# EAGLE design inktime_schematic (EAGLE 9.7.0)

## Sheet 1 of 2
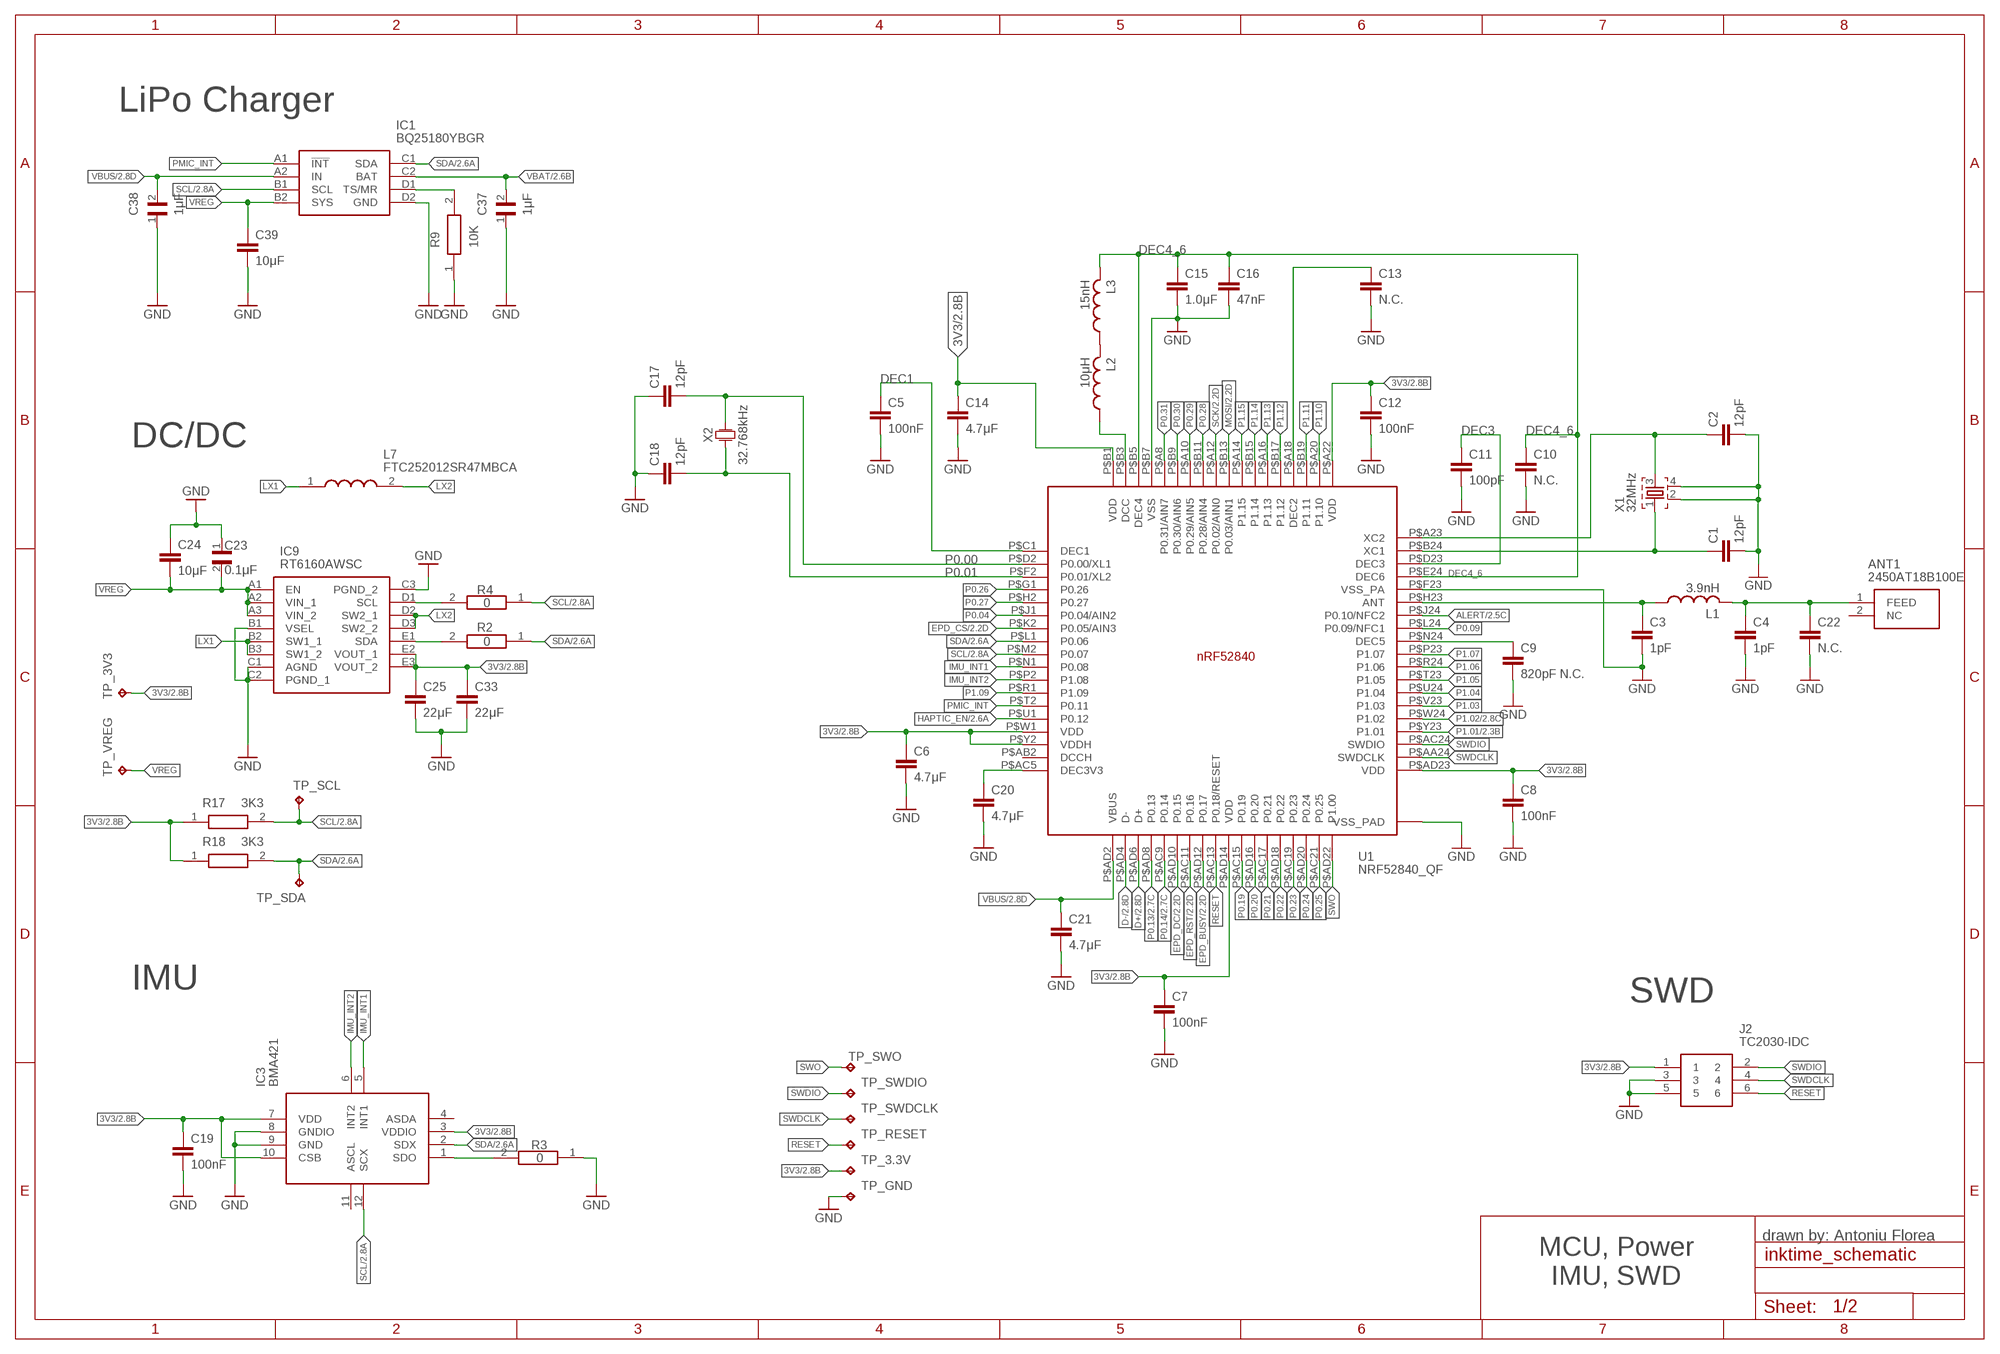
[diagram p0: schematic, sheet 1]

### Parts
ANT1  2450AT18B100E  2450AT18B100E_2450AT18B100E  [2450AT18B100E_ANTC3216X140N]
C1  12pF  NORDIC_NRF_3_CAPACITOR_0201_L  [NORDIC_NRF_3_RESC0201_L]
C2  12pF  NORDIC_NRF_3_CAPACITOR_0201_L  [NORDIC_NRF_3_RESC0201_L]
C3  1pF  NORDIC_NRF_3_CAPACITOR_0201_L  [NORDIC_NRF_3_RESC0201_L]
C4  1pF  NORDIC_NRF_3_CAPACITOR_0201_L  [NORDIC_NRF_3_RESC0201_L]
C5  100nF  NORDIC_NRF_3_CAPACITOR_0201_L  [NORDIC_NRF_3_RESC0201_L]
C6  4.7μF  NORDIC_NRF_3_CAPACITOR_0402_L  [NORDIC_NRF_3_RESC0402_L]
C7  100nF  NORDIC_NRF_3_CAPACITOR_0201_L  [NORDIC_NRF_3_RESC0201_L]
C8  100nF  NORDIC_NRF_3_CAPACITOR_0201_L  [NORDIC_NRF_3_RESC0201_L]
C9  820pF N.C.  NORDIC_NRF_3_CAPACITOR_0201_L  [NORDIC_NRF_3_RESC0201_L]
C10  N.C.  NORDIC_NRF_3_CAPACITOR_0201_L  [NORDIC_NRF_3_RESC0201_L]
C11  100pF  NORDIC_NRF_3_CAPACITOR_0201_L  [NORDIC_NRF_3_RESC0201_L]
C12  100nF  NORDIC_NRF_3_CAPACITOR_0201_L  [NORDIC_NRF_3_RESC0201_L]
C13  N.C.  NORDIC_NRF_3_CAPACITOR_0201_L  [NORDIC_NRF_3_RESC0201_L]
C14  4.7μF  NORDIC_NRF_3_CAPACITOR_0402_L  [NORDIC_NRF_3_RESC0402_L]
C15  1.0μF  NORDIC_NRF_3_CAPACITOR_0402_L  [NORDIC_NRF_3_RESC0402_L]
C16  47nF  NORDIC_NRF_3_CAPACITOR_0201_L  [NORDIC_NRF_3_RESC0201_L]
C17  12pF  NORDIC_NRF_3_CAPACITOR_0201_L  [NORDIC_NRF_3_RESC0201_L]
C18  12pF  NORDIC_NRF_3_CAPACITOR_0201_L  [NORDIC_NRF_3_RESC0201_L]
C19  100nF  NORDIC_NRF_3_CAPACITOR_0201_L  [NORDIC_NRF_3_RESC0201_L]
C20  4.7μF  NORDIC_NRF_3_CAPACITOR_0402_L  [NORDIC_NRF_3_RESC0402_L]
C21  4.7μF  NORDIC_NRF_3_CAPACITOR_0402_L  [NORDIC_NRF_3_RESC0402_L]
C22  N.C.  NORDIC_NRF_3_CAPACITOR_0201_L  [NORDIC_NRF_3_RESC0201_L]
C23  0.1μF  GRM011R60J152KE01L_2_GRM011R60J152KE01L  [GRM011R60J152KE01L_2_CAPC0201X13N]
C24  10μF  NORDIC_NRF_3_CAPACITOR_0402_L  [NORDIC_NRF_3_RESC0402_L]
C25  22μF  NORDIC_NRF_3_CAPACITOR_0402_L  [NORDIC_NRF_3_RESC0402_L]
C33  22μF  NORDIC_NRF_3_CAPACITOR_0402_L  [NORDIC_NRF_3_RESC0402_L]
C37  1μF  GRM011R60J152KE01L_2_GRM011R60J152KE01L  [GRM011R60J152KE01L_2_CAPC0201X13N]
C38  1μF  GRM011R60J152KE01L_2_GRM011R60J152KE01L  [GRM011R60J152KE01L_2_CAPC0201X13N]
C39  10μF  NORDIC_NRF_3_CAPACITOR_0402_L  [NORDIC_NRF_3_RESC0402_L]
IC1  BQ25180YBGR  BQ25180YBGR_BQ25180YBGR  [BQ25180YBGR_BGA8C40P2X4_100X155X50]
IC3  BMA421  BMA423_BMA423  [BMA423_BMA423]
IC9  RT6160AWSC  RT6160AWSC_RT6160AWSC  [RT6160AWSC_BGA15C40P3X5_140X230X60]
J2  TC2030-IDC  TC2030-IDC_TC2030-IDC  [TC2030-IDC_TC2030IDC]
L1  3.9nH  NORDIC_NRF_2_INDUCTOR_0201_L  [NORDIC_NRF_2_RESC0201_L]
L2  10μH  NORDIC_NRF_2_INDUCTOR_0201_L  [NORDIC_NRF_2_RESC0201_L]
L3  15nH  NORDIC_NRF_2_INDUCTOR_0201_L  [NORDIC_NRF_2_RESC0201_L]
L7  FTC252012SR47MBCA  MLP2016SR47MT0S1_FTC252012SR47MBCA  [MLP2016SR47MT0S1_INDC2016X100N]
R2  0  CPF0201D7K68C1_CPF0201D7K68C1  [CPF0201D7K68C1_0201]
R3  0  CPF0201D7K68C1_CPF0201D7K68C1  [CPF0201D7K68C1_0201]
R4  0  CPF0201D7K68C1_CPF0201D7K68C1  [CPF0201D7K68C1_0201]
R9  10K  ERA-1AEB3401C_CPF0201D7K68C1  [ERA-1AEB3401C_0201]
R17  3K3  CPF0201D7K68C1_CPF0201D7K68C1  [CPF0201D7K68C1_0201]
R18  3K3  CPF0201D7K68C1_CPF0201D7K68C1  [CPF0201D7K68C1_0201]
TP_3.3V  HECTOR_WATCH_1_TPTP20R  [HECTOR_WATCH_1_TP20R]
TP_3V3  HECTOR_WATCH_1_TPTP20R  [HECTOR_WATCH_1_TP20R]
TP_GND  HECTOR_WATCH_1_TPTP20R  [HECTOR_WATCH_1_TP20R]
TP_RESET  HECTOR_WATCH_1_TPTP20R  [HECTOR_WATCH_1_TP20R]
TP_SCL  HECTOR_WATCH_1_TPTP20R  [HECTOR_WATCH_1_TP20R]
TP_SDA  HECTOR_WATCH_1_TPTP20R  [HECTOR_WATCH_1_TP20R]
TP_SWDCLK  HECTOR_WATCH_1_TPTP20R  [HECTOR_WATCH_1_TP20R]
TP_SWDIO  HECTOR_WATCH_1_TPTP20R  [HECTOR_WATCH_1_TP20R]
TP_SWO  HECTOR_WATCH_1_TPTP20R  [HECTOR_WATCH_1_TP20R]
TP_VREG  HECTOR_WATCH_1_TPTP20R  [HECTOR_WATCH_1_TP20R]
U1  NRF52840_QF  NORDIC_NRF_4_NRF52840_QF  [NORDIC_NRF_4_AQFN50P700X700X85_HS-74N]
X1  32MHz  NORDIC_NRF_XTAL_32MHZ  [NORDIC_NRF_BT-XTAL_2016_N]
X2  32.768kHz  FC-135  [XTAL330X1051X90N]

### Nets
3V3: C6.1 C7.1 C8.1 C12.1 C14.1 C19.1 C25.1 C33.1 IC3.3(VDDIO) IC3.7(VDD) IC3.10(CSB) IC9.E2(VOUT_1) IC9.E3(VOUT_2) J2.1 R17.1 R18.1 TP_3.3V.TP TP_3V3.TP U1.P$A22(VDD) U1.P$AD14(VDD) U1.P$AD23(VDD) U1.P$B1(VDD) U1.P$W1(VDD) U1.P$Y2(VDDH) ; also sheet 2
ALERT: U1.P$J24(P0.10/NFC2) ; also sheet 2
D+: U1.P$AD6(D+) ; also sheet 2
D-: U1.P$AD4(D-) ; also sheet 2
DEC1: C5.1 U1.P$C1(DEC1)
DEC3: C11.1 U1.P$D23(DEC3)
DEC4_6: C10.1 C15.1 C16.1 L3.2 U1.P$B5(DEC4) U1.P$E24(DEC6)
EPD_BUSY: U1.P$AD12(P0.17) ; also sheet 2
EPD_CS: U1.P$K2(P0.05/AIN3) ; also sheet 2
EPD_DC: U1.P$AD10(P0.15) ; also sheet 2
EPD_RST: U1.P$AC11(P0.16) ; also sheet 2
GND: C1.2 C2.2 C3.2 C4.2 C5.2 C6.2 C7.2 C8.2 C9.2 C10.2 C11.2 C12.2 C13.2 C14.2 C15.2 C16.2 C17.1 C18.1 C19.2 C20.2 C21.2 C22.2 C23.1 C24.1 C25.2 C33.2 C37.1 C38.1 C39.2 IC1.D2(GND) IC3.8(GNDIO) IC3.9(GND) IC9.B1(VSEL) IC9.C1(AGND) IC9.C2(PGND_1) IC9.C3(PGND_2) J2.3 J2.5 R3.1 R9.1 TP_GND.TP U1.P$74(VSS_PAD) U1.P$75(VSS_PAD) U1.P$76(VSS_PAD) U1.P$77(VSS_PAD) U1.P$78(VSS_PAD) U1.P$79(VSS_PAD) U1.P$80(VSS_PAD) U1.P$81(VSS_PAD) U1.P$82(VSS_PAD) U1.P$83(VSS_PAD) U1.P$84(VSS_PAD) U1.P$85(VSS_PAD) U1.P$86(VSS_PAD) U1.P$87(VSS_PAD) U1.P$88(VSS_PAD) U1.P$89(VSS_PAD) U1.P$90(VSS_PAD) U1.P$B7(VSS) U1.P$F23(VSS_PA) X1.2 X1.4 ; also sheet 2
HAPTIC_EN: U1.P$U1(P0.12) ; also sheet 2
IMU_INT1: IC3.5(INT1) U1.P$N1(P0.08)
IMU_INT2: IC3.6(INT2) U1.P$P2(P1.08)
LX1: IC9.B2(SW1_1) IC9.B3(SW1_2) L7.1
LX2: IC9.D2(SW2_1) IC9.D3(SW2_2) L7.2
MOSI: U1.P$B13(P0.03/AIN1) ; also sheet 2
N$1: C1.1 U1.P$B24(XC1) X1.1
N$2: C3.1 L1.1 U1.P$H23(ANT)
N$3: C2.1 U1.P$A23(XC2) X1.3
N$4: ANT1.1(FEED) C4.1 C22.1 L1.2
N$5: C9.1 U1.P$N24(DEC5)
N$6: C20.1 U1.P$AC5(DEC3V3)
N$7: L2.1 U1.P$B3(DCC)
N$8: L2.2 L3.1
N$9: IC9.D1(SCL) R4.2
N$10: C13.1 U1.P$A18(DEC2)
N$12: IC1.D1(TS/MR) R9.2
N$13: IC9.E1(SDA) R2.2
N$19: IC3.1(SDO) R3.2
P0.00: C17.2 U1.P$D2(P0.00/XL1) X2.2
P0.01: C18.2 U1.P$F2(P0.01/XL2) X2.1
P0.04: U1.P$J1(P0.04/AIN2)
P0.09: U1.P$L24(P0.09/NFC1)
P0.13: U1.P$AD8(P0.13) ; also sheet 2
P0.14: U1.P$AC9(P0.14) ; also sheet 2
P0.19: U1.P$AC15(P0.19)
P0.20: U1.P$AD16(P0.20)
P0.21: U1.P$AC17(P0.21)
P0.22: U1.P$AD18(P0.22)
P0.23: U1.P$AC19(P0.23)
P0.24: U1.P$AD20(P0.24)
P0.25: U1.P$AC21(P0.25)
P0.26: U1.P$G1(P0.26)
P0.27: U1.P$H2(P0.27)
P0.28: U1.P$B11(P0.28/AIN4)
P0.29: U1.P$A10(P0.29/AIN5)
P0.30: U1.P$B9(P0.30/AIN6)
P0.31: U1.P$A8(P0.31/AIN7)
P1.01: U1.P$Y23(P1.01) ; also sheet 2
P1.02: U1.P$W24(P1.02) ; also sheet 2
P1.03: U1.P$V23(P1.03)
P1.04: U1.P$U24(P1.04)
P1.05: U1.P$T23(P1.05)
P1.06: U1.P$R24(P1.06)
P1.07: U1.P$P23(P1.07)
P1.09: U1.P$R1(P1.09)
P1.10: U1.P$A20(P1.10)
P1.11: U1.P$B19(P1.11)
P1.12: U1.P$B17(P1.12)
P1.13: U1.P$A16(P1.13)
P1.14: U1.P$B15(P1.14)
P1.15: U1.P$A14(P1.15)
PMIC_INT: IC1.A1(!INT) U1.P$T2(P0.11)
RESET: J2.6 TP_RESET.TP U1.P$AC13(P0.18/RESET)
SCK: U1.P$A12(P0.02/AIN0) ; also sheet 2
SCL: IC1.B1(SCL) IC3.12(SCX) R4.1 R17.2 TP_SCL.TP U1.P$M2(P0.07) ; also sheet 2
SDA: IC1.C1(SDA) IC3.2(SDX) R2.1 R18.2 TP_SDA.TP U1.P$L1(P0.06) ; also sheet 2
SWDCLK: J2.4 TP_SWDCLK.TP U1.P$AA24(SWDCLK)
SWDIO: J2.2 TP_SWDIO.TP U1.P$AC24(SWDIO)
SWO: TP_SWO.TP U1.P$AD22(P1.00)
VBAT: C37.2 IC1.C2(BAT) ; also sheet 2
VBUS: C21.1 C38.2 IC1.A2(IN) U1.P$AD2(VBUS) ; also sheet 2
VREG: C23.2 C24.2 C39.1 IC1.B2(SYS) IC9.A1(EN) IC9.A2(VIN_1) IC9.A3(VIN_2) TP_VREG.TP
Unconnected: ANT1.2(NC) IC3.4(ASDA) IC3.11(ASCL) U1.P$AB2(DCCH)

### Notes on the sheet
- LiPo Charger
- DC/DC
- IMU
- SWD
- drawn by: Antoniu Florea
- MCU, Power
  IMU, SWD

## Sheet 2 of 2
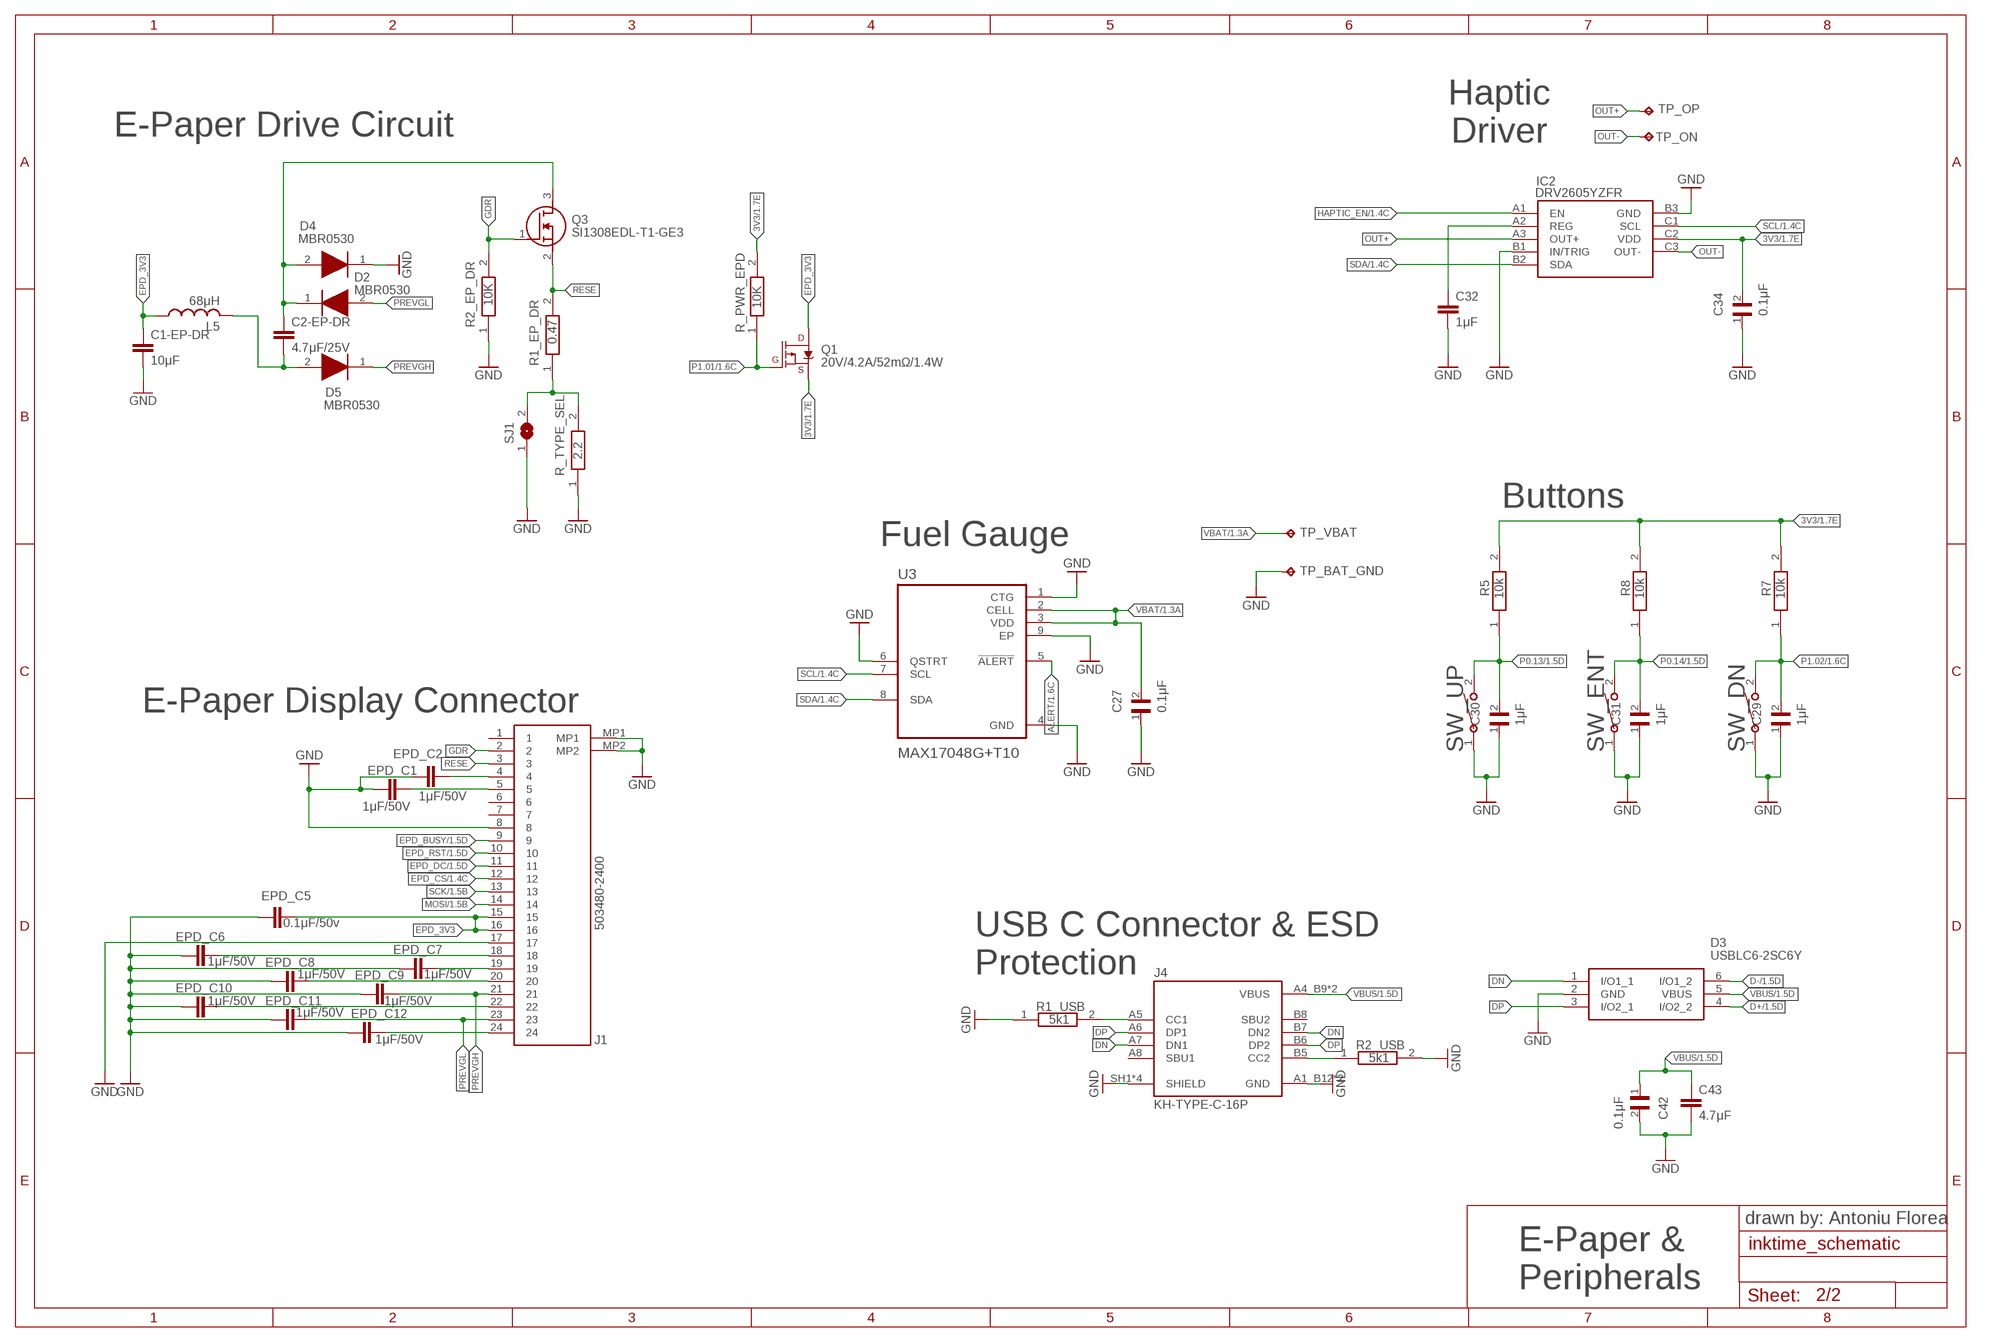
[diagram p1: schematic, sheet 2]

### Parts
C1-EP-DR  10μF  NORDIC_NRF_3_CAPACITOR_0402_L  [NORDIC_NRF_3_RESC0402_L]
C2-EP-DR  4.7μF/25V  NORDIC_NRF_3_CAPACITOR_0402_L  [NORDIC_NRF_3_RESC0402_L]
C27  0.1μF  GRM011R60J152KE01L_2_GRM011R60J152KE01L  [GRM011R60J152KE01L_2_CAPC0201X13N]
C29  1μF  GRM011R60J152KE01L_2_GRM011R60J152KE01L  [GRM011R60J152KE01L_2_CAPC0201X13N]
C30  1μF  GRM011R60J152KE01L_2_GRM011R60J152KE01L  [GRM011R60J152KE01L_2_CAPC0201X13N]
C31  1μF  GRM011R60J152KE01L_2_GRM011R60J152KE01L  [GRM011R60J152KE01L_2_CAPC0201X13N]
C32  1μF  NORDIC_NRF_3_CAPACITOR_0402_L  [NORDIC_NRF_3_RESC0402_L]
C34  0.1μF  GRM011R60J152KE01L_2_GRM011R60J152KE01L  [GRM011R60J152KE01L_2_CAPC0201X13N]
C42  0.1μF  GRM011R60J152KE01L_2_GRM011R60J152KE01L  [GRM011R60J152KE01L_2_CAPC0201X13N]
C43  4.7μF  NORDIC_NRF_3_CAPACITOR_0402_L  [NORDIC_NRF_3_RESC0402_L]
D2  MBR0530  ESP32_C6_LIBRARY_5_MBR0530  [ESP32_C6_LIBRARY_5_SOD3716X135N]
D3  USBLC6-2SC6Y  ESP32_C6_LIBRARY_3_USBLC6-2SC6Y  [ESP32_C6_LIBRARY_3_SOT95P280X145-6N]
D4  MBR0530  ESP32_C6_LIBRARY_5_MBR0530  [ESP32_C6_LIBRARY_5_SOD3716X135N]
D5  MBR0530  ESP32_C6_LIBRARY_5_MBR0530  [ESP32_C6_LIBRARY_5_SOD3716X135N]
EPD_C1  1μF/50V  NORDIC_NRF_3_CAPACITOR_0402_L  [NORDIC_NRF_3_RESC0402_L]
EPD_C2  1μF/50V  NORDIC_NRF_3_CAPACITOR_0402_L  [NORDIC_NRF_3_RESC0402_L]
EPD_C5  0.1μF/50v  NORDIC_NRF_3_CAPACITOR_0201_L  [NORDIC_NRF_3_RESC0201_L]
EPD_C6  1μF/50V  NORDIC_NRF_3_CAPACITOR_0402_L  [NORDIC_NRF_3_RESC0402_L]
EPD_C7  1μF/50V  NORDIC_NRF_3_CAPACITOR_0402_L  [NORDIC_NRF_3_RESC0402_L]
EPD_C8  1μF/50V  NORDIC_NRF_3_CAPACITOR_0402_L  [NORDIC_NRF_3_RESC0402_L]
EPD_C9  1μF/50V  NORDIC_NRF_3_CAPACITOR_0402_L  [NORDIC_NRF_3_RESC0402_L]
EPD_C10  1μF/50V  NORDIC_NRF_3_CAPACITOR_0402_L  [NORDIC_NRF_3_RESC0402_L]
EPD_C11  1μF/50V  NORDIC_NRF_3_CAPACITOR_0402_L  [NORDIC_NRF_3_RESC0402_L]
EPD_C12  1μF/50V  NORDIC_NRF_3_CAPACITOR_0402_L  [NORDIC_NRF_3_RESC0402_L]
IC2  DRV2605YZFR  DRV2605YZFR_DRV2605YZFR  [DRV2605YZFR_BGA9C50P3X3_144X144X62]
J1  503480-2400  503480-2400_503480-2400  [503480-2400_5034802400]
J4  KH-TYPE-C-16P  KH-TYPE-C-16P_KH-TYPE-C-16P  [KH-TYPE-C-16P_KINGHELM_KH-TYPE-C-16P]
L5  68μH  NORDIC_NRF_2_INDUCTOR_0402_L  [NORDIC_NRF_2_RESC0402_L]
Q1  20V/4.2A/52mΩ/1.4W  ESP32_C6_LIBRARY_4_ESP32_WROVER_SPARKFUN-DISCRETESEMI_MOSFET_PCH-DMG2305UX-7  [ESP32_C6_LIBRARY_4_ESP32_C6_LIBRARY_4_ESP32_C6_LIBRARY_4_ESP32_C6_LIBRARY_4_ESP32_WROVER_SPARKFUN-DISCRETESEMI_SOT23-3]
Q3  SI1308EDL-T1-GE3  ESP32_C6_LIBRARY_6_SI1308EDL-T1-GE3  [ESP32_C6_LIBRARY_6_SOT65P210X110-3N]
R1_EP_DR  0.47  CPF0201D7K68C1_CPF0201D7K68C1  [CPF0201D7K68C1_0201]
R1_USB  5k1  ERA-1AEB3401C_CPF0201D7K68C1  [ERA-1AEB3401C_0201]
R2_EP_DR  10K  CPF0201D7K68C1_CPF0201D7K68C1  [CPF0201D7K68C1_0201]
R2_USB  5k1  ERA-1AEB3401C_CPF0201D7K68C1  [ERA-1AEB3401C_0201]
R5  10k  CPF0201D7K68C1_CPF0201D7K68C1  [CPF0201D7K68C1_0201]
R7  10k  CPF0201D7K68C1_CPF0201D7K68C1  [CPF0201D7K68C1_0201]
R8  10k  CPF0201D7K68C1_CPF0201D7K68C1  [CPF0201D7K68C1_0201]
R_PWR_EPD  10K  CPF0201D7K68C1_CPF0201D7K68C1  [CPF0201D7K68C1_0201]
R_TYPE_SEL  2.2  CPF0201D7K68C1_CPF0201D7K68C1  [CPF0201D7K68C1_0201]
SJ1  ESP32_C6_LIBRARY_7_JUMPER_SJ  [ESP32_C6_LIBRARY_7_JUMPER_SJ]
SW_DN  2025-10-22_07-23-44_LIBRARY_EVP-AKE31ASW_EVP-AKE31A_PAN  [2025-10-22_07-23-44_LIBRARY_SW_EVP-AKE31A_PAN]
SW_ENT  2025-10-22_07-23-44_LIBRARY_EVP-AKE31ASW_EVP-AKE31A_PAN  [2025-10-22_07-23-44_LIBRARY_SW_EVP-AKE31A_PAN]
SW_UP  2025-10-22_07-23-44_LIBRARY_EVP-AKE31ASW_EVP-AKE31A_PAN  [2025-10-22_07-23-44_LIBRARY_SW_EVP-AKE31A_PAN]
TP_BAT_GND  HECTOR_WATCH_1_TPTP20R  [HECTOR_WATCH_1_TP20R]
TP_ON  HECTOR_WATCH_1_TPTP20R  [HECTOR_WATCH_1_TP20R]
TP_OP  HECTOR_WATCH_1_TPTP20R  [HECTOR_WATCH_1_TP20R]
TP_VBAT  HECTOR_WATCH_1_TPTP20R  [HECTOR_WATCH_1_TP20R]
U3  MAX17048G+T10  ESP32_C6_LIBRARY_MAX17048G+T10  [ESP32_C6_LIBRARY_SON50P200X200X80-9N]

### Nets
3V3: C34.2 IC2.C2(VDD) Q1.2(S) R5.2 R7.2 R8.2 R_PWR_EPD.2 ; also sheet 1
ALERT: U3.5(!ALERT) ; also sheet 1
D+: D3.4(I/O2_2) ; also sheet 1
D-: D3.6(I/O1_2) ; also sheet 1
DN: D3.1(I/O1_1) J4.A7(DN1) J4.B7(DN2)
DP: D3.3(I/O2_1) J4.A6(DP1) J4.B6(DP2)
EPD_3V3: C1-EP-DR.1 EPD_C5.2 J1.15 J1.16 L5.1 Q1.3(D)
EPD_BUSY: J1.9 ; also sheet 1
EPD_CS: J1.12 ; also sheet 1
EPD_DC: J1.11 ; also sheet 1
EPD_RST: J1.10 ; also sheet 1
GDR: J1.2 Q3.1(G) R2_EP_DR.2
GND: C1-EP-DR.2 C27.1 C29.1 C30.1 C31.1 C32.2 C34.1 C42.2 C43.2 D3.2(GND) D4.1(K) EPD_C1.2 EPD_C2.2 EPD_C5.1 EPD_C6.2 EPD_C7.2 EPD_C8.2 EPD_C9.2 EPD_C10.2 EPD_C11.2 EPD_C12.2 IC2.B1(IN/TRIG) IC2.B3(GND) J1.8 J1.17 J1.MP1 J1.MP2 J4.A1_B12(GND) J4.A12_B1(GND) J4.SH1(SHIELD) J4.SH2(SHIELD) J4.SH3(SHIELD) J4.SH4(SHIELD) R1_USB.1 R2_EP_DR.1 R2_USB.2 R_TYPE_SEL.1 SJ1.1 SW_DN.1 SW_ENT.1 SW_UP.1 TP_BAT_GND.TP U3.1(CTG) U3.4(GND) U3.6(QSTRT) U3.9(EP) ; also sheet 1
HAPTIC_EN: IC2.A1(EN) ; also sheet 1
MOSI: J1.14 ; also sheet 1
N$11: C2-EP-DR.2 D5.2(A) L5.2
N$14: C2-EP-DR.1 D2.1(K) D4.2(A) Q3.3(D)
N$15: EPD_C2.1 J1.4
N$16: R1_EP_DR.1 R_TYPE_SEL.2 SJ1.2
N$17: C32.1 IC2.A2(REG)
N$18: EPD_C1.1 J1.5
N$20: EPD_C6.1 J1.18
N$21: EPD_C7.1 J1.19
N$22: EPD_C8.1 J1.20
N$23: J4.A5(CC1) R1_USB.2
N$24: EPD_C10.1 J1.22
N$26: EPD_C12.1 J1.24
N$28: J4.B5(CC2) R2_USB.1
OUT+: IC2.A3(OUT+) TP_OP.TP
OUT-: IC2.C3(OUT-) TP_ON.TP
P0.13: C30.2 R5.1 SW_UP.2 ; also sheet 1
P0.14: C31.2 R8.1 SW_ENT.2 ; also sheet 1
P1.01: Q1.1(G) R_PWR_EPD.1 ; also sheet 1
P1.02: C29.2 R7.1 SW_DN.2 ; also sheet 1
PREVGH: D5.1(K) EPD_C9.1 J1.21
PREVGL: D2.2(A) EPD_C11.1 J1.23
RESE: J1.3 Q3.2(S) R1_EP_DR.2
SCK: J1.13 ; also sheet 1
SCL: IC2.C1(SCL) U3.7(SCL) ; also sheet 1
SDA: IC2.B2(SDA) U3.8(SDA) ; also sheet 1
VBAT: C27.2 TP_VBAT.TP U3.2(CELL) U3.3(VDD) ; also sheet 1
VBUS: C42.1 C43.1 D3.5(VBUS) J4.A4_B9(VBUS) J4.A9_B4(VBUS) ; also sheet 1
Unconnected: J1.1 J1.6 J1.7 J4.A8(SBU1) J4.B8(SBU2)

### Notes on the sheet
- Haptic
  Driver
- E-Paper Drive Circuit
- Buttons
- Fuel Gauge
- E-Paper Display Connector
- USB C Connector & ESD
  Protection
- drawn by: Antoniu Florea
- E-Paper &
  Peripherals

## Library data of the parts
ANT1 = InkTime_v5:2450AT18B100E_2450AT18B100E: Antennas 2.45GHz ANTENNA Source: Datasheet <https://www.johansontechnology.com/datasheets/2450AT18B100/2450AT18B100.pdf>; ARROW_PART_NUMBER: 2450AT18B100E; ARROW_PRICE-STOCK: https://www.arrow.com/en/products/2450at18b100e/johanson-dielectrics?utm_currency=USD&region=nac; DESCRIPTION: Antennas 2.45GHz ANTENNA; HEIGHT: 1.4mm; MANUFACTURER_NAME: JOHANSON TECHNOLOGY; MANUFACTURER_PART_NUMBER: 2450AT18B100E; MOUSER_PART_NUMBER: 609-2450AT18B100E; MOUSER_PRICE-STOCK: https://www.mouser.co.uk/ProductDetail/Johanson-Technology/2450AT18B100E?qs=yCnrNFeXz%252Bh5MFsFIXGZGA%3D%3D
C1 C1-EP-DR C2 C2-EP-DR C3-C22 C24 C25 C32 C33 C39 C43 EPD_C1 EPD_C2 EPD_C5-EPD_C12 = InkTime_v5:NORDIC_NRF_3_CAPACITOR: Generic chip capacitor
C23 C27 C29-C31 C34 C37 C38 C42 = InkTime_v5:GRM011R60J152KE01L_2_GRM011R60J152KE01L: Check availability <https://pricing.snapeda.com/parts/GRM011R60J152KE01L/Murata/view-part?ref=eda>; AVAILABILITY: In Stock; CHECK_PRICES: https://www.snapeda.com/parts/GRM011R60J152KE01L/Murata/view-part/?ref=eda; DESCRIPTION: SMD Capacitor X5R(EIA) with Capacitance: 1500pF Tol. 10%. Rated Voltage: 6.3Vdc; MF: Murata; MP: GRM011R60J152KE01L; PACKAGE: 0201 Murata; PRICE: None; SNAPEDA_LINK: https://www.snapeda.com/parts/GRM011R60J152KE01L/Murata/view-part/?ref=snap
D2 D4 D5 = InkTime_v5:ESP32_C6_LIBRARY_5_MBR0530: ON SEMICONDUCTOR - MBR0530 - DIODE, SCHOTTKY, 0.5A, 30V, SOD-123 Source: Datasheet <http://www.onsemi.com/pub/Collateral/MBR0530T1-D.PDF> Check availability <https://pricing.snapeda.com/parts/MBR0530/ON%20Semiconductor/view-part?ref=eda>; AVAILABILITY: In Stock; CHECK_PRICES: https://www.snapeda.com/parts/MBR0530/Onsemi/view-part/?ref=eda; DESCRIPTION: Diode Schottky 30 V 500mA Surface Mount SOD-123; MF: ON Semiconductor; MP: MBR0530; PACKAGE: SOD-123-2 ON Semiconductor; PRICE: None; PURCHASE-URL: https://www.snapeda.com/api/url_track_click_mouser/?unipart_id=179458&manufacturer=ON Semiconductor&part_name=MBR0530&search_term=None; SNAPEDA_LINK: https://www.snapeda.com/parts/MBR0530/Onsemi/view-part/?ref=snap
D3 = InkTime_v5:ESP32_C6_LIBRARY_3_USBLC6-2SC6Y: Low Cap. ESD Protection Auto SOT-23-6 STMicroelectronics USBLC6-2SC6Y, Dual Uni-Directional TVS Diode Array, 6-Pin SOT-23 Source: Datasheet <https://componentsearchengine.com/Datasheets/1/USBLC6-2SC6Y.pdf> Check availability <https://pricing.snapeda.com/parts/USBLC6-2SC6Y/STMicroelectronics/view-part?ref=eda>; AVAILABILITY: In Stock; CHECK_PRICES: https://www.snapeda.com/parts/USBLC6-2SC6Y/STMicroelectronics/view-part/?ref=eda; DESCRIPTION: 17V Clamp 5A (8/20µs) Ipp Tvs Diode Surface Mount SOT-23-6; MF: STMicroelectronics; MP: USBLC6-2SC6Y; PACKAGE: SOT-23-6 STMicroelectronics; PRICE: None; SNAPEDA_LINK: https://www.snapeda.com/parts/USBLC6-2SC6Y/STMicroelectronics/view-part/?ref=snap
IC1 = InkTime_v5:BQ25180YBGR_BQ25180YBGR: Charger IC Lithium Ion/Polymer, Lithium Iron Phosphate 8-DSBGA (1.6x1.1) Source: Datasheet <https://www.ti.com/lit/ds/symlink/bq25180.pdf?ts=1650264094470&ref_url=https%3A%2F%2Fwww.ti.com%2Fproduct%2FBQ25180>; ARROW_PART_NUMBER: BQ25180YBGR; ARROW_PRICE-STOCK: https://www.arrow.com/en/products/bq25180ybgr/texas-instruments?utm_currency=USD&region=nac; DESCRIPTION: Charger IC Lithium Ion/Polymer, Lithium Iron Phosphate 8-DSBGA (1.6x1.1); HEIGHT: 0.5mm; MANUFACTURER_NAME: Texas Instruments; MANUFACTURER_PART_NUMBER: BQ25180YBGR; MOUSER_PART_NUMBER: 595-BQ25180YBGR; MOUSER_PRICE-STOCK: https://www.mouser.co.uk/ProductDetail/Texas-Instruments/BQ25180YBGR?qs=doiCPypUmgEWjAK%252BJAX6Tw%3D%3D
IC2 = InkTime_v5:DRV2605YZFR_DRV2605YZFR: Haptic Driver for ERM/LRA with Built-In Library and Smart Loop Architecture Source: Datasheet <http://www.ti.com/lit/gpn/drv2605>; ARROW_PART_NUMBER: DRV2605YZFR; ARROW_PRICE-STOCK: https://www.arrow.com/en/products/drv2605yzfr/texas-instruments?region=nac; DESCRIPTION: Haptic Driver for ERM/LRA with Built-In Library and Smart Loop Architecture; HEIGHT: 0.625mm; MANUFACTURER_NAME: Texas Instruments; MANUFACTURER_PART_NUMBER: DRV2605YZFR
IC3 = InkTime_v5:BMA423_BMA423: Accelerometers Triaxial low-g 12bit Acceleration Sensor Source: Datasheet <https://www.mouser.com/datasheet/2/783/BST-BMA423-DS000-1509600.pdf>; ARROW_PART_NUMBER: BMA423; ARROW_PRICE-STOCK: https://www.arrow.com/en/products/bma423/bosch; DESCRIPTION: Accelerometers Triaxial low-g 12bit Acceleration Sensor; HEIGHT: 1mm; MANUFACTURER_NAME: BOSCH; MANUFACTURER_PART_NUMBER: BMA423; MOUSER_PART_NUMBER: 262-BMA423; MOUSER_PRICE-STOCK: https://www.mouser.co.uk/ProductDetail/Bosch-Sensortec/BMA423?qs=HXFqYaX1Q2xC%252BSgeGoX3mg%3D%3D
IC9 = InkTime_v5:RT6160AWSC_RT6160AWSC: Buck-Boost Regulator Positive Output Step-Up/Step-Down I2C DC-DC Controller IC 15-WL-CSP (BSC) (1.4x2.3) Source: Datasheet <https://www.richtek.com/SaveDownload.aspx?specid=RT6160A>; DESCRIPTION: Buck-Boost Regulator Positive Output Step-Up/Step-Down I2C DC-DC Controller IC 15-WL-CSP (BSC) (1.4x2.3); HEIGHT: 0.6mm; MANUFACTURER_NAME: RICHTEK; MANUFACTURER_PART_NUMBER: RT6160AWSC; MOUSER_PART_NUMBER: 835-RT6160AWSC; MOUSER_PRICE-STOCK: https://www.mouser.co.uk/ProductDetail/Richtek/RT6160AWSC?qs=amGC7iS6iy%2FLd9PSoixZXQ%3D%3D
J1 = InkTime_v5:503480-2400_503480-2400: FFC & FPC Connectors 0.5mm FPC RA SMT Dual Contact 24Ckt Source: Datasheet <https://componentsearchengine.com/Datasheets/1/503480-2400.pdf>; DESCRIPTION: FFC & FPC Connectors 0.5mm FPC RA SMT Dual Contact 24Ckt; HEIGHT: 1.87mm; MANUFACTURER_NAME: Molex; MANUFACTURER_PART_NUMBER: 503480-2400; MOUSER_PART_NUMBER: 538-503480-2400; MOUSER_PRICE-STOCK: https://www.mouser.co.uk/ProductDetail/Molex/503480-2400?qs=OAhjpuo3Vu7efIoxFh9AOw%3D%3D
J2 = InkTime_v5:TC2030-IDC_TC2030-IDC: CABLE ADAPTER 6 POS Source: Datasheet <https://datasheet.datasheetarchive.com/originals/distributors/Datasheets_SAMA/62bc384e093448baaaa63dbd0b9d8707.pdf>; DESCRIPTION: CABLE ADAPTER 6 POS; HEIGHT: 19mm; MANUFACTURER_NAME: Tag Connect; MANUFACTURER_PART_NUMBER: TC2030-IDC
J4 = InkTime_v5:KH-TYPE-C-16P_KH-TYPE-C-16P: Check availability <https://pricing.snapeda.com/parts/KH-TYPE-C-16P/kinghelm/view-part?ref=eda>; AVAILABILITY: Not in stock; CHECK_PRICES: https://www.snapeda.com/parts/KH-TYPE-C-16P/Kinghelm/view-part/?ref=eda; MF: kinghelm; MP: KH-TYPE-C-16P; PACKAGE: None; PRICE: None; SNAPEDA_LINK: https://www.snapeda.com/parts/KH-TYPE-C-16P/Kinghelm/view-part/?ref=snap
L1-L3 L5 = InkTime_v5:NORDIC_NRF_2_INDUCTOR: Generic chip inductor
L7 = InkTime_v5:MLP2016SR47MT0S1_FTC252012SR47MBCA: SMD / SMT Inductors (Coils), L=0.47?H, L x W x T : Source: Datasheet <https://product.tdk.com/system/files/dam/doc/product/inductor/inductor/smd/catalog/inductor_commercial_power_mlp2016_en.pdf>; DESCRIPTION: SMD / SMT Inductors (Coils), L=0.47?H, L x W x T :; HEIGHT: 1mm; JLCPCB: https://jlcpcb.com/partdetail/6763488-FTC252012SR47MBCA/C5832368; MANUFACTURER_NAME: TDK; MANUFACTURER_PART_NUMBER: FTC252012SR47MBCA
Q1 = InkTime_v5:ESP32_C6_LIBRARY_4_ESP32_WROVER_SPARKFUN-DISCRETESEMI_MOSFET_PCH: P-channel MOSFETs Voltage controlled devices that allow control of high current outputs. SparkFun Products: SparkFun ESP32 Thing <https://www.sparkfun.com/products/13907> SparkFun ESP8266 Thing <https://www.sparkfun.com/products/13231> SparkFun Pi Servo HAT V2 <https://www.sparkfun.com/products/15316> DMG2305UX-7 (20V/4.2A/SOT23-3); PROD_ID: TRAN-14388
Q3 = InkTime_v5:ESP32_C6_LIBRARY_6_SI1308EDL-T1-GE3: MOSFET N-Ch 30V 1.5A TrenchFET SC70 Vishay Si1308EDL-T1-GE3 N-channel MOSFET Transistor, 1.5 A, 30 V, 3-Pin SC-70 Source: Datasheet <https://componentsearchengine.com/Datasheets/1/SI1308EDL-T1-GE3.pdf> Check availability <https://pricing.snapeda.com/parts/SI1308EDL-T1-GE3/Vishay%20Siliconix/view-part?ref=eda>; AVAILABILITY: In Stock; CHECK_PRICES: https://www.snapeda.com/parts/SI1308EDL-T1-GE3/Vishay+Siliconix/view-part/?ref=eda; DESCRIPTION: Si1308EDL-T1-GE3 N-channel MOSFET Transistor, 1.5 A, 30 V, 3-Pin SC-70 | Siliconix / Vishay SI1308EDL-T1-GE3; MF: Vishay Siliconix; MP: SI1308EDL-T1-GE3; PACKAGE: SOT-323 Vishay Semiconductor; PRICE: None; PURCHASE-URL: https://www.snapeda.com/api/url_track_click_mouser/?unipart_id=274603&manufacturer=Vishay Siliconix&part_name=SI1308EDL-T1-GE3&search_term=None; SNAPEDA_LINK: https://www.snapeda.com/parts/SI1308EDL-T1-GE3/Vishay+Siliconix/view-part/?ref=snap
R1_EP_DR R2 R2_EP_DR R3-R5 R7 R8 R17 R18 R_PWR_EPD R_TYPE_SEL = InkTime_v5:CPF0201D7K68C1_CPF0201D7K68C1: 7.68k 0201 Thin Film Surface Mount Fixed Resistor +/-0.5% 0.031W CPF0201D7K68C1 Source: Datasheet <http://www.te.com/commerce/DocumentDelivery/DDEController?Action=showdoc&DocId=Data Sheet1773200-1ApdfEnglishENG_DS_1773200-1_A.pdf4-2176215-6>
R1_USB R2_USB R9 = InkTime_v5:ERA-1AEB3401C_CPF0201D7K68C1: 7.68k 0201 Thin Film Surface Mount Fixed Resistor +/-0.5% 0.031W CPF0201D7K68C1 Source: Datasheet <http://www.te.com/commerce/DocumentDelivery/DDEController?Action=showdoc&DocId=Data Sheet1773200-1ApdfEnglishENG_DS_1773200-1_A.pdf4-2176215-6>
SJ1 = InkTime_v5:ESP32_C6_LIBRARY_7_JUMPER_SJ: SMD solder JUMPER
SW_DN SW_ENT SW_UP = InkTime_v5:2025-10-22_07-23-44_LIBRARY_EVP-AKE31A; COPYRIGHT: Copyright (C) 2025 Ultra Librarian. All rights reserved.; DIGI-KEY_PART_NUMBER_1: P123437TR-ND; DIGI-KEY_PART_NUMBER_2: P123437CT-ND; DIGI-KEY_PART_NUMBER_3: P123437DKR-ND; MANUFACTURER_NAME: Panasonic; MANUFACTURER_PART_NUMBER: EVP-AKE31A
TP_3.3V TP_3V3 TP_BAT_GND TP_GND TP_ON TP_OP TP_RESET TP_SCL TP_SDA TP_SWDCLK TP_SWDIO TP_SWO TP_VBAT TP_VREG = InkTime_v5:HECTOR_WATCH_1_TP: Test pad
U1 = InkTime_v5:NORDIC_NRF_4_NRF52840_QF: nRF52840 Features Advanced Single chip 2.4 GHz multi-protocol SoC 32-bit ARM Cortex-M4F Processor 1.7v to 5.5v operation 1MB flash + 256kB RAM Bluetooth 5 support for long range and high throughput 802.15.4 radio support On-chip NFC PPI –Programmable Peripheral Interconnect Automated power management system with automatic power management of each peripheral Configurable I/O mapping for analog and digital I/O 48 x GPIO 1 x QSPI 4 x Master/Slave SPI 2 x Two-wire interface (I²C) I²S interface 2 x UART 4 x PWM USB 2.0 controller ARM TrustZone CryptoCell-310 Cryptographic and security module AES 128-bit ECB/CCM/AAR hardware accelerator Digital microphone interface (PDM) Quadrature decoder 12-bit ADC Low power comparator On-chip 50Ω balun On-air compatible with nRF52, nRF51 and nRF24 Series Applications Advanced high performance wearables Wearables for secure payments Virtual Reality/Augmented Reality systems Smart Home sensor networks Smart city sensor networks High performance HID controllers Internet of Things (IoT) sensor networks Smart door locks Smart lighting networks Connected white goods
U3 = InkTime_v5:ESP32_C6_LIBRARY_MAX17048G+T10: Check availability <https://pricing.snapeda.com/parts/MAX17048G%2BT10/Analog%20Devices/view-part?ref=eda>; AVAILABILITY: In Stock; CHECK_PRICES: https://www.snapeda.com/parts/MAX17048G+T10/Analog+Devices/view-part/?ref=eda; DESCRIPTION: 3µA 1-Cell/2-Cell Fuel Gauge with ModelGauge; MF: Analog Devices; MP: MAX17048G+T10; PACKAGE: TDFN-8 Maxim; PRICE: None; PURCHASE-URL: https://www.snapeda.com/api/url_track_click_mouser/?unipart_id=329239&manufacturer=Analog Devices&part_name=MAX17048G+T10&search_term=None; SNAPEDA_LINK: https://www.snapeda.com/parts/MAX17048G+T10/Analog+Devices/view-part/?ref=snap
X1 = InkTime_v5:NORDIC_NRF_XTAL_32MHZ
X2 = Frequency-Source:FC-135: CRYSTAL 32.7680KHZ SMD Reference: Datasheet <https://support.epson.biz/td/api/doc_check.php?dl=brief_FC-135&lang=en>; CATEGORY: Crystals; DATASHEET: https://download.epsondevice.com/td/pdf/app/FC-135_en.pdf; DESCRIPTION: 32.768 kHz ±20 ppm Crystal 12.5 pF 70 kOhms 2-SMD No Lead; FREQUENCY: 32.768 kHz; FREQUENCY_STABILITY: NA; LOAD_CAPACITANCE: 12.5 pF; MANUFACTURER: EPSON; MPN: FC-135 32.7680KA-A5; OPERATING_TEMPERATURE: -40°C ~ 85°C; PACKAGE_SIZE: 2-SMD No Lead; PACKAGE_TYPE: Surface Mount; PART_STATUS: Active; ROHS: Compliant; SERIES: FC-135; SUBCATEGORY: Oscillators; TOLERANCE: ±20 ppm; TYPE: Resonators

## Board
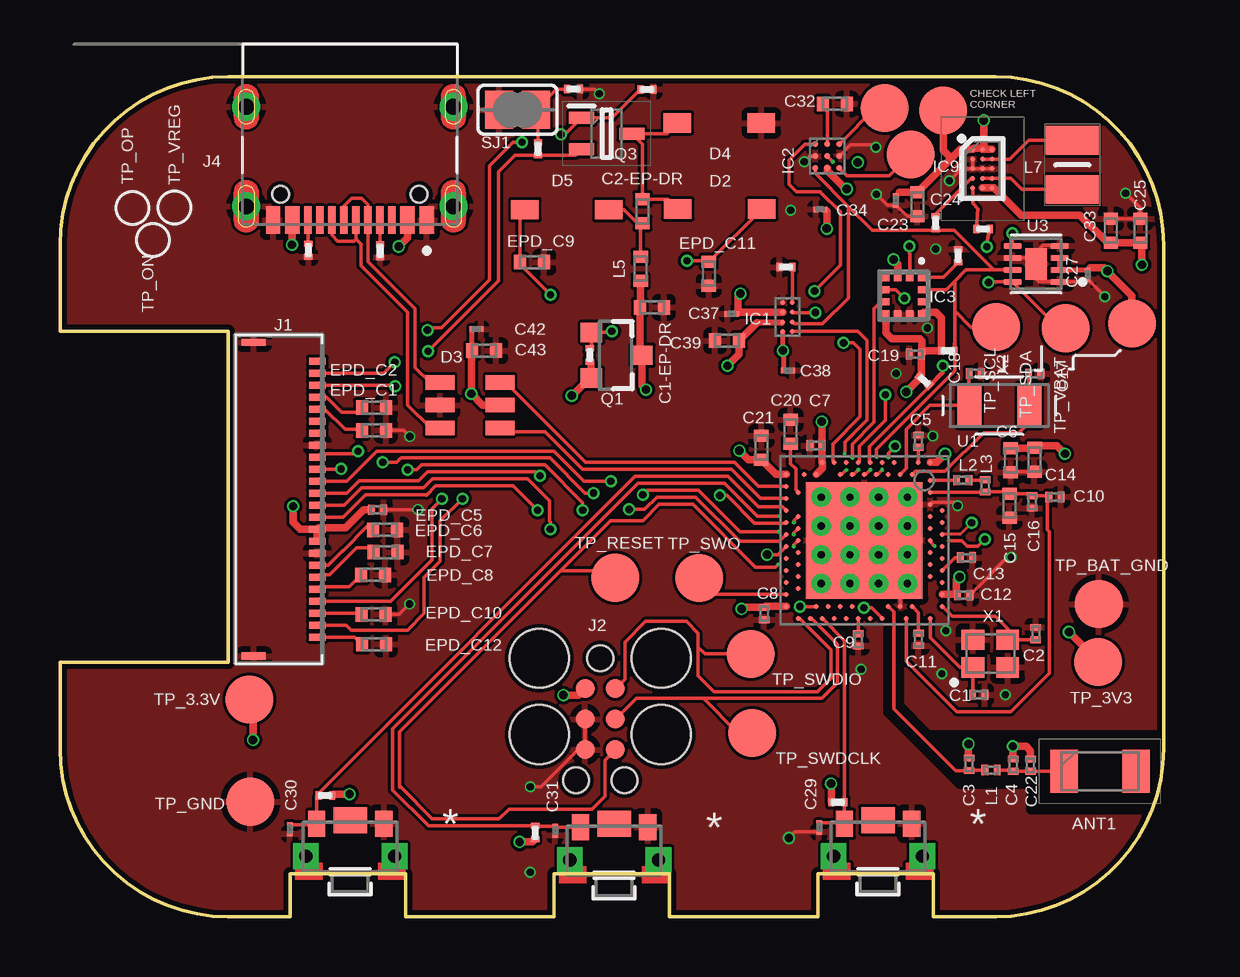
[diagram p2: board, top side]
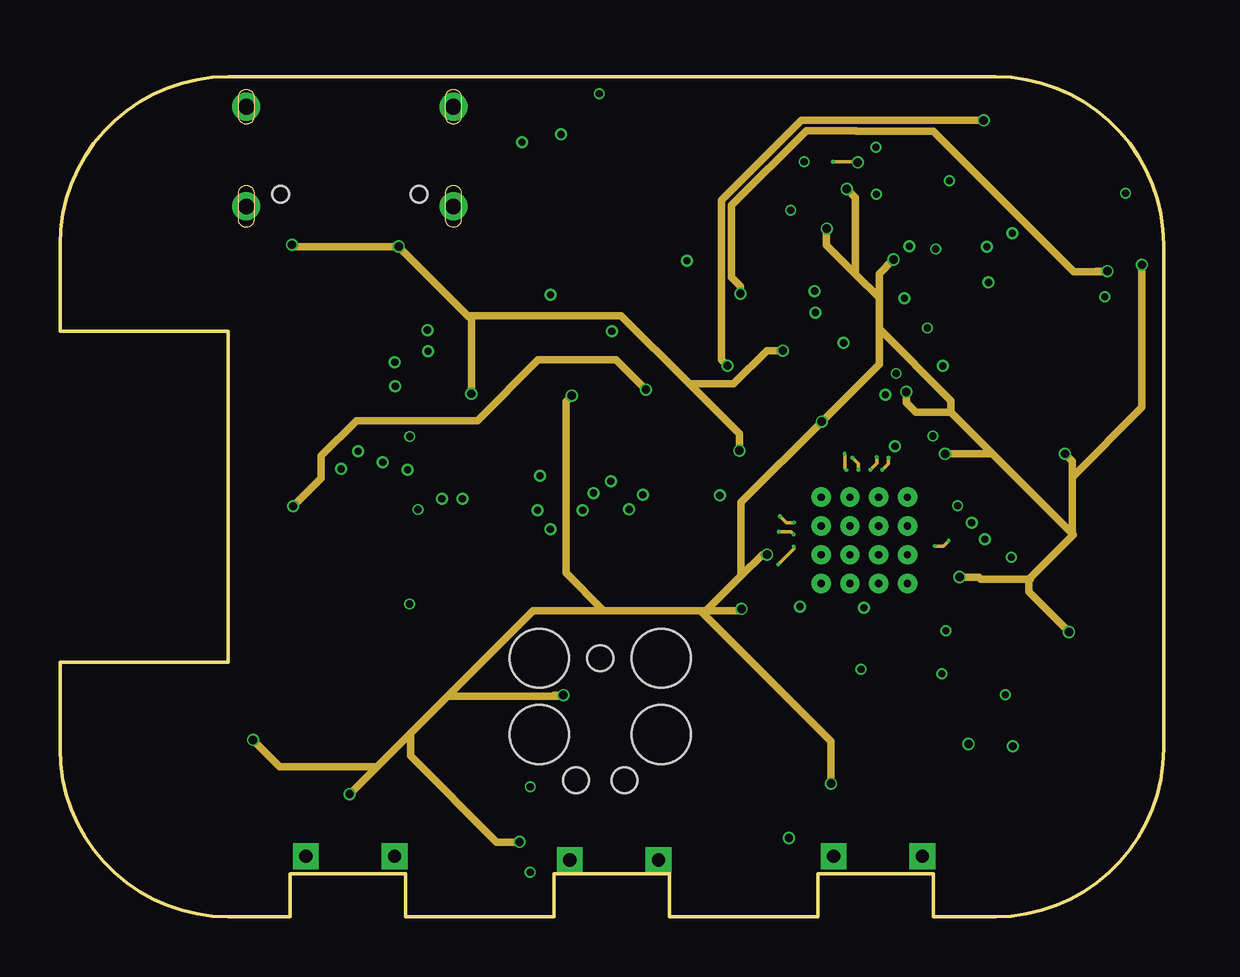
[diagram p3: board, inner layer Route2]
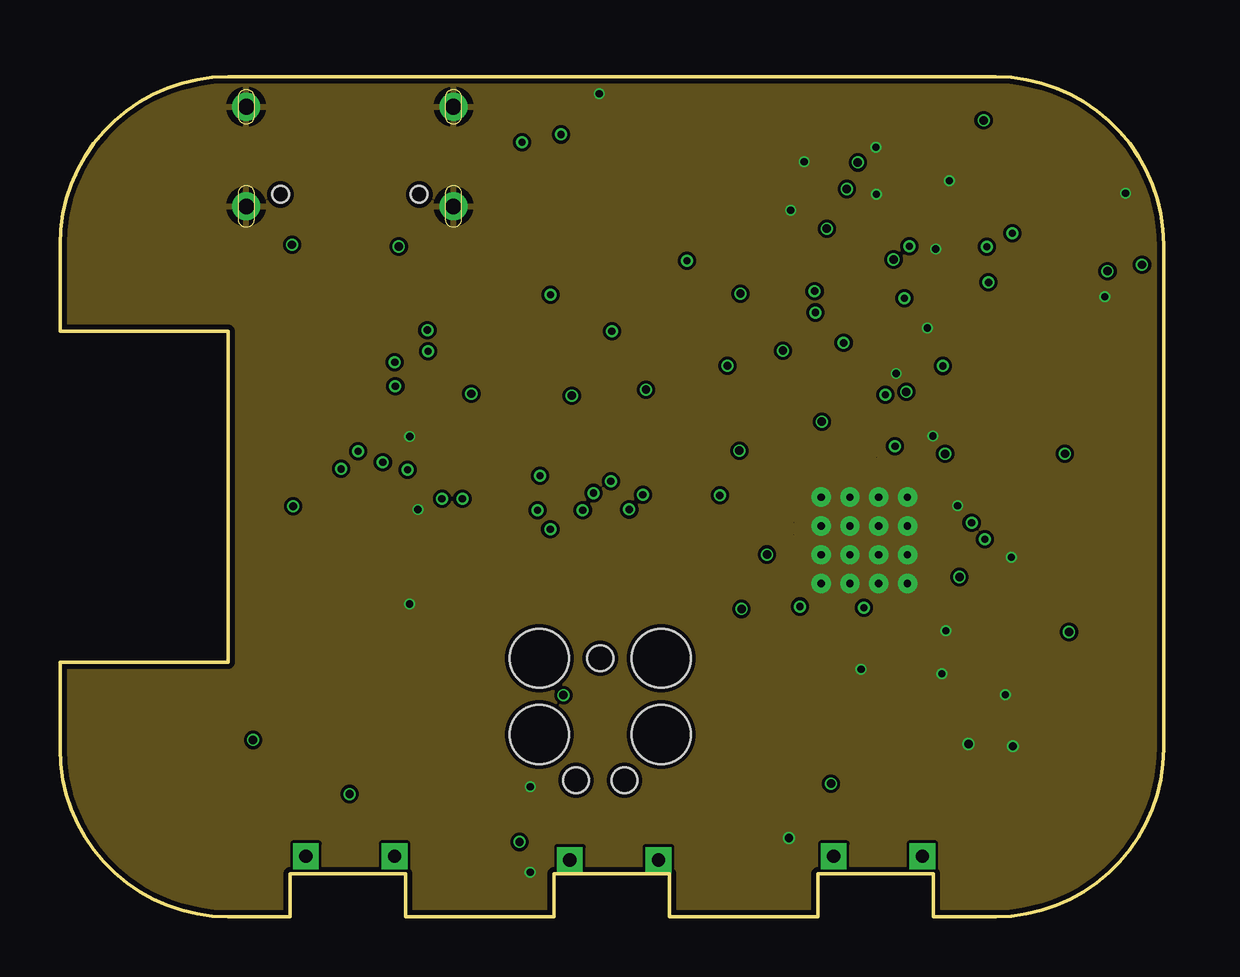
[diagram p4: board, inner layer Route15]
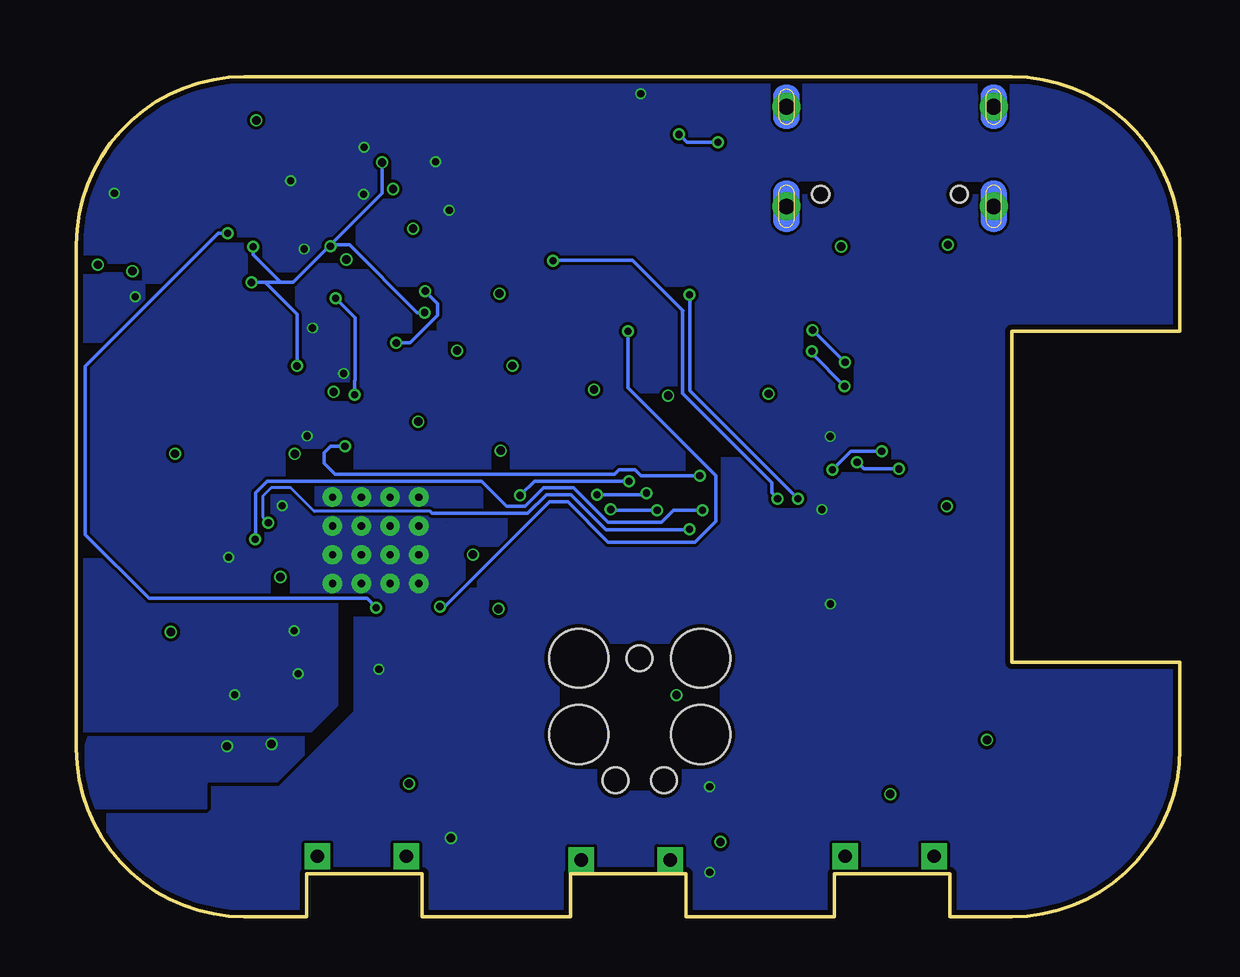
[diagram p5: board, bottom side, seen from below]

Size 46 x 35 mm. Coordinates in mm from the lower left corner, seen from the top.
Outline: 39,0 36.4,0 36.4,1.8 31.6,1.8 31.6,0 25.4,0 25.4,1.8 20.6,1.8 20.6,0 14.4,0 14.4,1.8 9.6,1.8 9.6,0 7,0 arc-90 0,7 0,10.6 7,10.6 7,24.4 0,24.4 0,28 arc-90 7,35 39,35 arc-90 46,28 46,7 arc-90 39,0
Copper layers ([2:1+2*15+16]): Top 0.035mm / dielectric 1.6mm / Route2 0.035mm / dielectric 0.15mm / Route15 0.035mm / dielectric 0.2mm / Bottom 0.035mm
Design rules "jlcpcb-2layers.dru *": minimum track width 5mil, minimum drill 0.3mm, track to track 5mil, track to pad 5mil, pad to pad 5mil, via to via 5mil, smd to smd 5mil, copper to edge 0.2mm, drill to drill 6mil, minimum pad ring 10mil, minimum via ring 3mil, stop-mask expansion 4mil, vias tented up to drill 0mil, thermal gap 10mil
tRestrict: 12 lines
bRestrict: 18 lines

### Footprints (pad centres in the part's own frame; a part is rotated, then mirrored left to right if it is on the bottom)
2450AT18B100E_ANTC3216X140N = smd 1.15 x 1.8: 1 -1.5,0; 2 1.5,0
NORDIC_NRF_3_RESC0201_L = smd 0.28 x 0.43: 1 -0.255,0; 2 0.255,0
NORDIC_NRF_3_RESC0402_L = smd 0.5 x 0.6: 1 -0.5,0; 2 0.5,0
GRM011R60J152KE01L_2_CAPC0201X13N = smd 0.22 x 0.23: 1 -0.185,0; 2 0.185,0
ESP32_C6_LIBRARY_5_SOD3716X135N = smd 1.15 x 0.8: 1 -1.75,0; 2 1.75,0
ESP32_C6_LIBRARY_3_SOT95P280X145-6N = smd 1.2 x 0.6: 1 -1.25,0.95; 2 -1.25,0; 3 -1.25,-0.95; 4 1.25,-0.95; 5 1.25,0; 6 1.25,0.95
BQ25180YBGR_BGA8C40P2X4_100X155X50 = smd 0.2 x 0.2: A1 -0.2,0.6; A2 0.2,0.6; B1 -0.2,0.2; B2 0.2,0.2; C1 -0.2,-0.2; C2 0.2,-0.2; D1 -0.2,-0.6; D2 0.2,-0.6
DRV2605YZFR_BGA9C50P3X3_144X144X62 = smd 0.25 x 0.25: A1 -0.5,0.5; A2 0,0.5; A3 0.5,0.5; B1 -0.5,0; B2 0,0; B3 0.5,0; C1 -0.5,-0.5; C2 0,-0.5; C3 0.5,-0.5
BMA423_BMA423 = smd 0.3 x 0.35: 1 -0.75,-0.775; 2 -0.25,-0.775; 3 0.25,-0.775; 4 0.75,-0.775; 7 0.75,0.775; 8 0.25,0.775; 9 -0.25,0.775; 10 -0.75,0.775 | smd 0.35 x 0.3: 5 0.775,-0.25; 6 0.775,0.25; 11 -0.775,0.25; 12 -0.775,-0.25
RT6160AWSC_BGA15C40P3X5_140X230X60 = smd 0.216 x 0.216: A1 -0.4,0.8; A2 0,0.8; A3 0.4,0.8; B1 -0.4,0.4; B2 0,0.4; B3 0.4,0.4; C1 -0.4,0; C2 0,0; C3 0.4,0; D1 -0.4,-0.4; D2 0,-0.4; D3 0.4,-0.4; E1 -0.4,-0.8; E2 0,-0.8; E3 0.4,-0.8
503480-2400_5034802400 = smd 0.3 x 0.7: 1 -5.75,1.525; 2 -5.25,1.525; 3 -4.75,1.525; 4 -4.25,1.525; 5 -3.75,1.525; 6 -3.25,1.525; 7 -2.75,1.525; 8 -2.25,1.525; 9 -1.75,1.525; 10 -1.25,1.525; 11 -0.75,1.525; 12 -0.25,1.525; 13 0.25,1.525; 14 0.75,1.525; 15 1.25,1.525; 16 1.75,1.525; 17 2.25,1.525; 18 2.75,1.525; 19 3.25,1.525; 20 3.75,1.525; 21 4.25,1.525; 22 4.75,1.525; 23 5.25,1.525; 24 5.75,1.525 | smd 0.3 x 1: MP1 -6.54,-1.125; MP2 6.54,-1.125
TC2030-IDC_TC2030IDC = smd 0.783 x 0.783: 1 -0.953,-0.635; 2 -0.953,0.635; 3 0.317,-0.635; 4 0.317,0.635; 5 1.588,-0.635; 6 1.588,0.635 | hole 2.451: -2.223,-2.54; -2.223,2.54; 0.952,-2.54; 0.952,2.54 | hole 1.067: -2.223,0; 2.857,-1.016; 2.857,1.016
KH-TYPE-C-16P_KINGHELM_KH-TYPE-C-16P = smd 0.6 x 1.15: A1_B12 -3.2,4.725; A4_B9 -2.4,4.725; A9_B4 2.4,4.725; A12_B1 3.2,4.725 | smd 0.3 x 1.15: A5 -1.25,4.725; A6 -0.25,4.725; A7 0.25,4.725; A8 1.25,4.725; B5 1.75,4.725; B6 0.75,4.725; B7 -0.75,4.725; B8 -1.75,4.725 | drill 0.65 pad 1.05: SH1 -4.32,0; SH2 4.32,0; SH3 -4.32,4.15; SH4 4.32,4.15 | hole 0.7: -2.89,3.65; 2.89,3.65
NORDIC_NRF_2_RESC0201_L = smd 0.28 x 0.43: 1 -0.255,0; 2 0.255,0
NORDIC_NRF_2_RESC0402_L = smd 0.5 x 0.6: 1 -0.5,0; 2 0.5,0
MLP2016SR47MT0S1_INDC2016X100N = smd 1.2 x 2.2: 1 -1.028,0; 2 1.028,0
ESP32_C6_LIBRARY_4_ESP32_C6_LIBRARY_4_ESP32_C6_LIBRARY_4_ESP32_C6_LIBRARY_4_ESP32_WROVER_SPARKFUN-DISCRETESEMI_SOT23-3 = smd 0.8 x 0.9: 1 -0.95,-1; 2 0.95,-1; 3 0,1.1
ESP32_C6_LIBRARY_6_SOT65P210X110-3N = smd 1.05 x 0.5: 1 -1.05,0.65; 2 -1.05,-0.65; 3 1.05,0
CPF0201D7K68C1_0201 = smd 0.35 x 0.25: 1 0,0.275; 2 0,-0.275
ERA-1AEB3401C_0201 = smd 0.35 x 0.25: 1 0,0.275; 2 0,-0.275
ESP32_C6_LIBRARY_7_JUMPER_SJ = smd 1.168 x 1.6: 1 -0.762,0; 2 0.762,0
2025-10-22_07-23-44_LIBRARY_SW_EVP-AKE31A_PAN = smd 0.711 x 1.092: 1 -1.4,-0.972; 2 1.4,-0.972 | drill 0.559 pad 0.914 square: 3 -1.848,0.381; 4 1.848,0.381 | smd 1.397 x 1.092: 5 0,-1.124
HECTOR_WATCH_1_TP20R = smd 2 x 2: TP 0,0
NORDIC_NRF_4_AQFN50P700X700X85_HS-74N = smd 4.85 x 4.85: P$74 0,0 | drill 0.3 pad 0.6: P$75 -1.8,1.8; P$76 -0.6,1.8; P$77 0.6,1.8; P$78 1.8,1.8; P$79 -1.8,0.6; P$80 -0.6,0.6; P$81 0.6,0.6; P$82 1.8,0.6; P$83 -1.8,-0.6; P$84 -0.6,-0.6; P$85 0.6,-0.6; P$86 1.8,-0.6; P$87 -1.8,-1.8; P$88 -0.6,-1.8; P$89 0.6,-1.8; P$90 1.8,-1.8 | smd 0.2 x 0.2: P$A8 -1.25,3.25; P$A10 -0.75,3.25; P$A12 -0.25,3.25; P$A14 0.25,3.25; P$A16 0.75,3.25; P$A18 1.25,3.25; P$A20 1.75,3.25; P$A22 2.25,3.25; P$A23 2.75,3.25; P$AA24 3.25,-2.25; P$AB2 -2.75,-2.5; P$AC5 -2,-2.75; P$AC9 -1,-2.75; P$AC11 -0.5,-2.75; P$AC13 0,-2.75; P$AC15 0.5,-2.75; P$AC17 1,-2.75; P$AC19 1.5,-2.75; P$AC21 2,-2.75; P$AC24 3.25,-2.75; P$AD2 -2.75,-3.25; P$AD4 -2.25,-3.25; P$AD6 -1.75,-3.25; P$AD8 -1.25,-3.25; P$AD10 -0.75,-3.25; P$AD12 -0.25,-3.25; P$AD14 0.25,-3.25; P$AD16 0.75,-3.25; P$AD18 1.25,-3.25; P$AD20 1.75,-3.25; P$AD22 2.25,-3.25; P$AD23 2.75,-3.25; P$B1 -3.25,2.75; P$B3 -2.5,2.75; P$B5 -2,2.75; P$B7 -1.5,2.75; P$B9 -1,2.75; P$B11 -0.5,2.75; P$B13 0,2.75; P$B15 0.5,2.75; P$B17 1,2.75; P$B19 1.5,2.75; P$B24 3.25,2.75; P$C1 -3.25,2.25; P$D2 -2.75,2; P$D23 2.75,2; P$E24 3.25,1.75; P$F2 -2.75,1.5; P$F23 2.75,1.5; P$G1 -3.25,1.25; P$H2 -2.75,1; P$H23 2.75,1; P$J1 -3.25,0.75; P$J24 3.25,0.75; P$K2 -2.75,0.5; P$L1 -3.25,0.25; P$L24 3.25,0.25; P$M2 -2.75,0; P$N1 -3.25,-0.25; P$N24 3.25,-0.25; P$P2 -2.75,-0.5; P$P23 2.75,-0.5; P$R1 -3.25,-0.75; P$R24 3.25,-0.75; P$T2 -2.75,-1; P$T23 2.75,-1; P$U1 -3.25,-1.25; P$U24 3.25,-1.25; P$V23 2.75,-1.5; P$W1 -3.25,-1.75; P$W24 3.25,-1.75; P$Y2 -2.75,-2; P$Y23 2.75,-2
ESP32_C6_LIBRARY_SON50P200X200X80-9N = smd 0.76 x 0.27: 1 -0.985,0.75; 2 -0.985,0.25; 3 -0.985,-0.25; 4 -0.985,-0.75; 5 0.985,-0.75; 6 0.985,-0.25; 7 0.985,0.25; 8 0.985,0.75 | smd 0.9 x 1.3: 9 0,0
NORDIC_NRF_BT-XTAL_2016_N = smd 0.95 x 0.85: 1 -0.725,-0.575; 2 0.725,-0.575; 3 0.725,0.575; 4 -0.725,0.575
XTAL330X1051X90N = smd 1 x 1.8: 1 -1.25,0; 2 1.25,0

### Placement (x,y rotation side)
ANT1  43.35,6.06 0 top
C1  38.3,9.25 0 top
C1-EP-DR  24.67,25.39 0 top
C2  40.67,11.8 90 top
C2-EP-DR  24.28,29.4 270 top
C3  37.89,6.35 90 top
C4  39.73,6.32 90 top
C5  35.78,19.81 90 top
C6  39.63,19.02 270 top
C7  31.51,19.63 180 top
C8  29.35,12.63 270 top
C9  33.28,11.54 270 top
C10  41.47,17.49 0 top
C11  35.79,11.55 270 top
C12  37.67,13.4 0 top
C13  37.79,14.96 0 top
C14  40.62,19.04 270 top
C15  39.58,17.13 270 top
C16  40.52,17.28 270 top
C17  40.63,22.63 180 top
C18  38.15,22.64 180 top
C19  35.65,23.44 180 top
C20  30.46,20.21 90 top
C21  29.23,19.54 90 top
C22  40.45,6.31 90 top
C23  34.84,29.84 90 top
C24  35.74,29.68 90 top
C25  45.03,28.59 90 top
C27  42.84,26.75 90 top
C29  31.65,3.72 90 top
C30  9.58,3.65 90 top
C31  20.64,3.59 90 top
C32  32.3,33.86 0 top
C33  43.8,28.58 90 top
C34  31.69,29.48 0 top
C37  28,25.12 0 top
C38  30.34,22.76 180 top
C39  27.81,24 180 top
C42  17.36,24.48 0 top
C43  17.68,23.59 0 top
D2  27.5,29.49 0 top
D3  17.09,21.32 0 top
D4  27.48,33.07 180 top
D5  21.13,29.46 0 top
EPD_C1  13.09,20.26 0 top
EPD_C2  13.09,21.21 0 top
EPD_C5  13.24,16.95 180 top
EPD_C6  13.56,16.12 0 top
EPD_C7  13.57,15.19 0 top
EPD_C8  13.05,14.24 0 top
EPD_C9  19.68,27.27 0 top
EPD_C10  13.07,12.59 0 top
EPD_C11  27.04,26.8 270 top
EPD_C12  13.09,11.35 0 top
IC1  30.33,24.99 180 top
IC2  31.98,31.69 0 top
IC3  35.17,25.88 180 top
IC9  38.45,31.17 0 top
J1  9.2,17.4 270 top
J2  22.52,8.55 270 top
J4  12.08,33.75 180 top
L1  38.8,6.11 0 top
L2  37.63,18.18 0 top
L3  38.56,17.95 270 top
L5  24.2,26.99 90 top
L7  42.2,31.33 270 top
Q1  23.15,23.4 270 top
Q3  22.79,32.63 0 top
R1_EP_DR  19.93,32 0 top
R1_USB  13.34,27.75 180 top
R2  38.48,28.66 270 top
R2_EP_DR  24.47,34.47 270 top
R2_USB  10.36,27.77 0 top
R3  37.44,27.54 0 top
R4  36.49,28.92 180 top
R5  11.06,5.05 90 top
R7  32.43,4.77 270 top
R8  19.81,3.51 0 top
R9  30.26,27.07 90 top
R17  37.01,23.58 90 top
R18  36.03,22.34 47.4 top
R_PWR_EPD  22.08,23.4 0 top
R_TYPE_SEL  21.41,34.48 270 top
SJ1  19.07,33.62 0 top
SW_DN  34.1,2.9 180 top
SW_ENT  23.1,2.75 180 top
SW_UP  12.1,2.9 180 top
TP_3.3V  7.89,9.05 0 top
TP_3V3  43.28,10.61 0 top
TP_BAT_GND  43.3,13.02 0 top
TP_GND  7.94,4.79 0 top
TP_ON  35.46,31.77 0 top
TP_OP  34.37,33.7 0 top
TP_RESET  23.14,14.12 0 top
TP_SCL  39.02,24.57 0 top
TP_SDA  41.91,24.52 0 top
TP_SWDCLK  28.85,7.66 0 top
TP_SWDIO  28.8,10.95 0 top
TP_SWO  26.65,14.1 0 top
TP_VBAT  44.69,24.72 0 top
TP_VREG  36.82,33.6 0 top
U1  33.53,15.68 270 top
U3  40.69,27.2 180 top
X1  38.78,10.96 0 top
X2  39.15,21.3 0 top

### Tracks (layer width: path | path; a pad name or v marks a point on that pad's centre or on a via)
3V3  (via drill 0.35, 0.35 pad 0.25)
  Top 0.15: U1.P$AD23 30.23,12.89 | v29.47,15.09 29.93,15.09 U1.P$AD14
  Top 0.2: C34.2 31.97,29.39
  Top 0.305: U1.P$AD23 29.4,12.93 C8.1 28.47,12.89 v28.41,12.82 | 37.37,13.43 U1.P$A22 | 37.37,13.43 C12.1 | R5.2 11.39,5.11 v12.07,5.11 | v20.99,9.23 21.62,9.23 J2.1 | v19.16,3.11 19.7,3.11 R8.2 | v32.14,5.54 32.15,5.53 R7.2 | 37.37,13.43 37.37,14.03 v37.5,14.15 | U1.P$B1 36.55,18.93 v36.9,19.29 | v35.28,21.87 35.83,22.42 R18.1 35.91,22.61 C19.1 | C19.1 36.05,23.58 R17.1 36.73,24.96 36.5,25.19 36,25.19 IC3.10 | C19.1 35.92,24 35.83,24.08 34.67,24.08 34.42,24.34 IC3.7 | U1.P$Y2 31.78,18.68 U1.P$W1 31.77,18.94 C7.1 31.75,19.65 v31.75,20.63 | v34.75,27.38 34.75,27.35 34.92,27.18 IC3.3 | v45.1,27.17 45.1,28.02 C25.1 C33.1 43.67,28.08 42.51,29.24 40.06,29.24 38.93,30.37 IC9.E3 IC9.E2 | R_PWR_EPD.2 22.13,23.08 22.13,22.47 Q1.2 22.07,22.45 v21.33,21.71 | v8.05,7.36 8.05,8.89 TP_3.3V.TP | v42.06,11.86 43.28,10.65 TP_3V3.TP | IC2.C2 31.98,31.07 32.73,30.32 v32.8,30.32 | 31.97,29.39 v31.97,28.67 | v41.89,19.29 41.54,19.63 40.72,19.63 C14.1 40.61,19.52 C6.1
  Route2 0.305: 13.22,6.25 14.61,7.64 | 14.61,7.64 16.16,9.19 | 16.16,9.19 19.72,12.75 22.67,12.75 | 22.67,12.75 26.7,12.75 | 26.7,12.75 26.94,12.75 | 26.94,12.75 28.34,12.75 v28.41,12.82 | 26.94,12.75 28.39,14.21 | 20.95,9.19 20.55,9.19 | 20.55,9.19 16.16,9.19 | 14.61,7.64 14.61,6.7 18.2,3.11 v19.15,3.11 v19.16,3.11 | 26.7,12.75 32.14,7.31 v32.14,5.54 | 40.39,14.07 42.23,15.92 42.2,15.95 | 42.2,18.32 42.2,15.95 | 40.45,14.07 40.39,14.07 | 40.39,14.07 38.39,14.07 38.31,14.15 v37.5,14.15 | 42.2,15.95 38.87,19.29 | 38.87,19.29 37.13,21.02 | 22.67,12.75 21.09,14.33 21.09,21.46 v21.33,21.71 | 37.13,21.02 35.67,21.02 35.28,21.42 v35.28,21.87 | 28.39,14.21 28.39,17.27 v31.75,20.63 v31.76,20.63 34.15,23.02 34.15,24.49 | 34.15,24.49 34.15,25.78 | 34.15,25.78 34.15,26.79 v34.75,27.38 | 34.15,25.78 33.16,26.77 | 33.16,26.77 31.95,27.98 31.95,28.65 v31.97,28.67 | 33.16,26.77 33.16,29.96 v32.8,30.32 | 42.2,18.32 45.1,21.22 v45.1,27.17 | 13.22,6.25 9.16,6.25 v8.05,7.36 | 40.39,14.07 40.39,13.54 v42.06,11.86 | v42.06,11.86 | v35.28,21.87 | v42.06,11.86 | 20.55,9.19 20.6,9.23 v20.99,9.23 | v32.14,5.54 | v32.14,5.54 | 13.22,6.25 v12.08,5.11 v12.07,5.11 | 42.2,18.32 42.2,18.97 v41.89,19.29 | v36.9,19.29 38.87,19.29 | 37.13,21.02 37.13,21.5 34.15,24.49 | 28.39,14.21 29.28,15.09 v29.47,15.09
ALERT  (via drill 0.3 pad 0.5)
  Top 0.15: U1.P$J24 33.84,12.87 v33.51,12.87 | v39.7,28.48 v39.7,28.47 U3.5
  Bottom 0.15: v33.51,12.87 33.89,13.26 42.97,13.26 45.63,15.92 45.63,22.94 40.09,28.48 v39.7,28.48
D+
  Top 0.15: D3.4 18.5,20.22 20.21,20.22 21.79,18.64 28,18.64 29.2,17.43 U1.P$AD6
D-
  Top 0.15: D3.6 18.58,22.27 21.91,18.94 28.11,18.94 29.12,17.93 U1.P$AD4
DEC1
  Top 0.15: U1.P$C1 C5.1
DEC3
  Top 0.15: C11.1 35.79,12.67 U1.P$D23
DEC4_6
  Top 0.15: U1.P$E24 35.28,10.65 37.38,8.55 39.64,8.55 41.23,10.14 41.23,16.05 41.16,16.12 41.16,17.44 C10.1 41.17,17.54 C16.1 40.43,17.63 C15.1 39.51,17.7 L3.2 38.55,17.68 U1.P$B5
DN
  Top 0.15: D3.1 15.42,22.27 14.8,22.88 14.8,25.33 12.83,27.3 J4.B7 12.83,29.67 12.57,29.93 12.15,29.93 11.83,29.62 J4.A7
DP
  Top 0.15: J4.A6 12.33,28.23 | 12.33,28.23 12.54,28.02 12.54,27.13 14.48,25.19 14.5,25.19 14.5,21.31 15.44,20.37 D3.3 | J4.B6 11.33,28.4 11.58,28.15 12.26,28.15 12.33,28.23
EPD_3V3  (via drill 0.35)
  Top 0.305: J1.15 10.78,16.2 11.9,16.2 12.66,16.95 EPD_C5.2 | J1.15 J1.16 | J1.15 10.01,16.15 9.72,16.44 v9.72,17.1 | L5.1 24.2,25.42 C1-EP-DR.1 24.17,23.48 Q1.3 24.25,22.13 v24.43,21.96
  Route2 0.305: v9.72,17.1 10.89,18.27 10.89,19.2 12.36,20.67 17.4,20.67 19.93,23.2 23.18,23.2 v24.43,21.96 | v9.72,17.1 | v9.72,17.1
EPD_BUSY  (via drill 0.3 pad 0.5)
  Top 0.15: J1.9 10.86,19.29 12.32,19.29 v12.43,19.39 | v14.49,18.62 14.86,18.62 15.07,18.83 20.22,18.83 21.79,17.26 v21.79,16.93 | v23.73,16.97 24.37,16.97 24.88,17.48 26.49,17.48 28.34,15.64 29.98,15.64 U1.P$AD12
  Bottom 0.15: v12.43,19.39 13.72,19.39 v14.49,18.62 | v21.79,16.93 23.7,16.93 v23.73,16.97
EPD_CS  (via drill 0 layers 1-2, 0.3 pad 0.5)
  Top 0.15: J1.12 11.95,17.65 12.47,18.17 14.95,18.17 14.96,18.16 15.33,18.54 19.85,18.54 v20.01,18.37 | v34.81,19.6 34.53,19.32 v34.53,19.14 | v34.28,18.62 34.09,18.43 U1.P$K2
  Route2 0.15: v34.53,19.14 34.53,18.88 v34.28,18.62
  Bottom 0.15: v20.01,18.37 22.47,18.37 22.71,18.62 23.38,18.62 23.56,18.44 35.22,18.44 35.67,18.89 35.67,19.32 35.4,19.6 v34.81,19.6
EPD_DC  (via drill 0.3 pad 0.5)
  Top 0.15: J1.11 11.95,18.15 13.2,19.4 20.6,19.4 21.85,18.14 v22.96,18.14 | v27.5,17.55 27.8,17.55 28.96,16.4 30.24,16.4 U1.P$AD10
  Bottom 0.15: v22.96,18.14 26.91,18.14 v27.5,17.55
EPD_RST  (via drill 0 layers 1-2, 0.3 pad 0.5)
  Top 0.15: J1.10 v11.71,18.65 v11.71,18.66 | v13.46,18.93 14.03,18.93 14.21,19.12 20.43,19.12 21.9,17.65 v22.24,17.65 | v24.3,17.59 24.47,17.77 26.61,17.77 28.34,16.04 v29.96,16.04 | 30.76,16.17 U1.P$AC11
  Top 0.152: v30.58,15.92 30.58,15.99 U1.P$AC11
  Route2 0.15: v29.96,16.04 30.46,16.04 v30.58,15.92
  Bottom 0.15: v11.71,18.66 13.18,18.66 v13.46,18.93 | v24.3,17.59 v24.29,17.58 22.32,17.58 v22.24,17.65
GDR  (via drill 0.3 pad 0.5)
  Top 0.15: R2_EP_DR.2 23.01,33.28 Q3.1 21.05,32.59 v20.88,32.59 | J1.2 13.5,22.65 v13.96,23.11 | v15.31,24.45 15.41,24.54 15.92,24.54 17.92,26.54 17.92,31.29 18.89,32.27 v19.26,32.27
  Bottom 0.15: v13.96,23.11 15.29,24.45 v15.31,24.45 | v19.26,32.27 20.55,32.27 v20.88,32.59
GND  (via drill 0.3, 0.35)
  Top 0.15: C33.2 C25.2 45.03,29.53 v44.42,30.15 | v43.55,25.83 43.55,25.86 C27.1 42.72,26.45 U3.1 40.8,26.45 40.69,26.56 U3.9 40.69,27.37 | 40.69,27.37 40.69,27.67 41,27.98 41.64,27.98 U3.4 | U3.6 40.61,27.45 40.69,27.37 | IC9.C1 IC9.C2 IC9.C3 | IC9.B1 IC9.C1 | IC9.C1 37.57,31.17 v37.07,30.66 | C24.1 35.31,29.18 C23.1 34.48,29.65 v34.03,30.1 | IC2.B3 32.95,32.16 33.91,32.16 v34.01,32.06 | IC2.B1 31.25,31.69 v31.02,31.46 | U1.P$B7 36.36,17.27 37.27,17.27 v37.42,17.12 | U1.P$F23 35.03,13.58 U1.P$78 | C6.2 39.65,18.54 C14.2 | EPD_C10.2 14.14,12.59 v14.57,13.03 | EPD_C5.1 14.91,16.95 v14.92,16.96 | v19.61,5.42 20.05,5.42 21.59,6.96 J2.5 J2.3 | EPD_C1.2 14.33,20.26 v14.58,20.01 | C12.2 39.5,14.97 v39.66,14.97 | R_TYPE_SEL.1 22.29,34.48 v22.48,34.29 | C29.1 30.64,3.53 v30.39,3.28
  Top 0.152: U1.P$74 U1.P$80
  Top 0.305: C3.2 37.87,6.63 v37.87,7.2 | C4.2 v39.73,7.1 | v39.73,7.1 v39.72,7.1 | C22.2 40.45,6.92 40.28,7.1 v39.73,7.1
  other vias: 36.76,10.12 39.4,9.25 36.92,11.91 30.46,29.43 36.5,27.82 36.16,24.53 34.86,22.63 19.6,1.86 33.39,10.32 36.38,20.03
  pour Bottom: -4.48,-4.2 52.04,-4.2 52.44,38.48 -5.63,38.38 -5.63,-3.05
  pour Route15: -5.61,-4.61 50.95,-4.61 51.25,-4.31 51.25,37.65 50.86,38.03 -5.65,38.12 -5.65,-4.57
  pour Top: 51.51,7.86 51.54,7.85 51.6,7.79 51.6,38.29 51.54,38.35 -5.09,38.23 -5.09,-4.24 -4.97,-4.37 45.64,-4.37 45.64,3.98 45.44,4.18 40.41,4.18 40.38,4.19 40.2,4.37 40.19,4.4 40.19,5.25 37.42,5.25 37.39,5.26 34.25,8.41 34.24,8.43 34.24,12.65 34.25,12.68 34.35,12.79 34.38,12.8 35.15,12.8 35.18,12.79 35.24,12.73 35.25,12.7 35.25,8.88 36.27,7.86
HAPTIC_EN  (via drill 0.3 pad 0.5)
  Top 0.15: IC2.A1 31.05,32.19 30.38,31.52 30.38,30.52 30.71,30.2 31.7,30.2 31.73,30.17 32.53,29.37 32.53,27.14 v31.46,26.07 | v32.67,23.91 33.08,23.91 33.35,23.64 33.35,20.82 32.21,19.69 32.21,18.99 U1.P$U1
  Bottom 0.15: v31.46,26.07 30.94,25.55 30.94,25.05 32.09,23.91 v32.67,23.91
IMU_INT1  (via drill 0.3 pad 0.5)
  Top 0.15: IC3.5 34.84,26.13 v35.19,25.77 | v34.4,21.74 34.4,20.68 33.32,19.6 33.32,18.98 U1.P$N1
  Bottom 0.15: v35.19,25.77 34.39,24.96 34.39,22.35 34.4,22.33 v34.4,21.74
IMU_INT2  (via drill 0 layers 1-2)
  Top 0.15: IC3.6 34.22,25.63 33.92,25.33 33.92,20.61 33.93,20.6 33.03,19.69 v33.03,19.13 v33.03,19.12 | v33.28,18.63 33.09,18.43 U1.P$P2
  Route2 0.15: v33.03,19.12 33.28,18.87 v33.28,18.63
LX1
  Top 0.15: L7.1 40.38,32.36 39.59,31.57 IC9.B3 IC9.B2
LX2
  Top 0.15: L7.2 40.09,30.3 39.63,30.77 IC9.D3 IC9.D2
MOSI  (via drill 0 layers 1-2, 0.3 pad 0.5)
  Top 0.15: J1.14 11.8,16.65 12.74,17.59 15.26,17.59 15.28,17.56 15.66,17.95 | 15.66,17.95 | 15.66,17.95 18.89,17.95 v19.9,16.94 | v38.55,15.73 38.27,15.44 37.81,15.44 37.59,15.66 v37.05,15.66 | v36.46,15.44 36.28,15.62 U1.P$B13
  Route2 0.15: v37.05,15.66 36.83,15.44 v36.46,15.44
  Bottom 0.15: v19.9,16.94 21.11,16.94 21.61,16.43 23.84,16.43 25.27,17.87 26.54,17.87 27.3,17.1 28.08,17.1 29.12,18.14 38.05,18.14 38.53,17.66 38.53,15.75 v38.55,15.73
N$1
  Top 0.15: C1.1 X1.1 37.52,10.39 36.28,11.63 U1.P$B24
N$2
  Top 0.15: U1.P$H23 34.75,12.71 34.75,8.67 37.34,6.08 37.87,6.08 C3.1 L1.1
N$3
  Top 0.15: U1.P$A23 37.2,12.51 38.98,12.51 39.5,11.99 X1.3 C2.1
N$4
  Top 0.15: L1.2 39.68,6.11 C4.1 C22.1 ANT1.1
N$5
  Top 0.15: U1.P$N24 C9.1
N$6
  Top 0.15: C20.1 30.46,18.88 30.68,18.66 30.68,17.78 U1.P$AC5
N$7
  Top 0.15: U1.P$B3 L2.1
N$8
  Top 0.15: L2.2 38.54,18.18 L3.1
N$9
  Top 0.15: R4.2 36.49,29.26 38,30.77 IC9.D1
N$10
  Top 0.15: C13.1 37.3,14.96 U1.P$A18
N$11
  Top 0.15: L5.2 24.2,28.77 | 24.2,28.77 24.2,28.82 C2-EP-DR.2 | D5.2 23.51,29.46 24.2,28.77
N$12
  Top 0.15: R9.2 IC1.D1
N$13
  Top 0.15: R2.2 38.27,29.51 38.04,29.73 IC9.E1
N$14
  Top 0.15: D2.1 25.33,29.91 C2-EP-DR.1 24.28,32.19 Q3.3 25.3,32.63 D4.2
N$15
  Top 0.15: J1.4 11.11,21.65 11.74,21.03 12.4,21.03 EPD_C2.1
N$16
  Top 0.15: R_TYPE_SEL.2 20.7,34.48 SJ1.2 19.93,33.53 R1_EP_DR.1
N$17
  Top 0.15: C32.1 31.98,33.68 IC2.A2
N$18
  Top 0.15: J1.5 11.04,21.15 11.88,20.31 12.54,20.31 EPD_C1.1
N$19
  Top 0.15: R3.2 36.83,26.65 IC3.1
N$20
  Top 0.15: EPD_C6.1 12.88,16.31 12.85,16.31 11.78,15.24 11.19,14.65 J1.18
N$21
  Top 0.15: J1.19 10.82,14.24 11.25,14.24 12.37,15.36 12.9,15.36 EPD_C7.1
N$22
  Top 0.15: J1.20 10.82,13.74 12.06,13.74 EPD_C8.1
N$23
  Top 0.15: R1_USB.2 J4.A5
N$24
  Top 0.15: J1.22 12.52,12.65 EPD_C10.1
N$26
  Top 0.15: J1.24 12.29,11.65 EPD_C12.1
N$28
  Top 0.15: R2_USB.1 10.33,28.06 J4.B5
OUT+
  Top 0.15: IC2.A3 33.99,33.7 TP_OP.TP
OUT-
  Top 0.15: IC2.C3 32.8,30.87 34.57,30.87 TP_ON.TP
P0.00
  Top 0.15: U1.P$D2 35.66,18.57 36.9,18.57 38.5,20.17 39.96,20.17 39.98,20.16 40.4,20.58 X2.2 40.38,21.33 C17.2
P0.01
  Top 0.15: U1.P$F2 35.27,18.68 35.27,20.31 36.27,21.3 X2.1 | X2.1 38.09,21.3 | C18.2 37.89,21.31 X2.1
P0.13
  Top 0.15: C30.2 10.66,3.83 SW_UP.2 10.7,4.97 R5.1 10.78,5.15 23.98,18.34 27.85,18.34 29.1,17.08 30.12,17.08 U1.P$AD8
P0.14  (via drill 0 layers 1-2)
  Top 0.15: SW_ENT.2 20.69,3.72 C31.2 R8.1 15.36,3.78 13.87,5.27 13.87,7.83 24.1,18.06 | 24.1,18.06 | 24.1,18.06 27.7,18.06 29.07,16.68 v30.01,16.68 v30.01,16.69
  Top 0.152: v30.59,16.42 30.59,16.5 U1.P$AC9
  Route2 0.15: v30.01,16.69 30.27,16.42 v30.59,16.42
P1.01  (via drill 0.3 pad 0.5)
  Top 0.15: v23,24.39 22.96,24.34 Q1.1 22.15,23.75 R_PWR_EPD.1 | v30.85,12.92 31.52,12.92 U1.P$Y23
  Bottom 0.15: v23,24.39 23,22.03 19.35,18.38 19.35,16.48 20.22,15.61 23.84,15.61 25.52,17.29 26.29,17.29 30.65,12.92 v30.85,12.92
P1.02
  Top 0.15: U1.P$W24 32.7,11.51 R7.1 SW_DN.2 32.67,3.9 C29.2
PMIC_INT  (via drill 0 layers 1-2)
  Top 0.15: IC1.A1 33.26,24.39 33.63,24.02 33.63,20.69 32.71,19.78 v32.71,19.29 | v32.78,18.61 32.6,18.43 U1.P$T2
  Route2 0.15: v32.71,19.29 32.71,18.68 v32.78,18.61
PREVGH  (via drill 0.3 pad 0.5)
  Top 0.15: J1.21 13.78,13.15 15.51,14.88 15.51,17 v15.92,17.41 | v20.45,25.91 19.18,27.18 EPD_C9.1 19.18,29.26 D5.1
  Bottom 0.15: v15.92,17.41 20.43,21.92 20.43,25.9 v20.45,25.91 | v15.92,17.41
PREVGL  (via drill 0.3 pad 0.5)
  Top 0.15: J1.23 11.92,12.15 12.14,11.93 14.48,11.93 15.19,12.63 15.19,14.13 15.18,14.14 15.85,14.81 15.85,16.5 v16.77,17.42 | v26.14,27.33 27.01,27.33 EPD_C11.1 27.06,27.3 D2.2
  Bottom 0.15: v16.77,17.42 17.01,17.66 17.01,18.09 20.73,21.82 20.73,25.25 22.83,27.36 26.11,27.36 v26.14,27.33
RESE  (via drill 0.3 pad 0.5)
  Top 0.15: J1.3 13.94,22.15 v13.98,22.11 | v15.35,23.56 17,25.21 18.29,26.5 18.29,31.05 18.97,31.73 R1_EP_DR.2 21.48,31.73 Q3.2
  Bottom 0.15: v13.98,22.11 15.35,23.47 v15.35,23.56
RESET  (via drill 0 layers 1-2)
  Top 0.15: J2.6 22.72,6.52 22.72,5.03 22.17,4.48 18.72,4.48 18.31,4.07 15.52,4.07 14.21,5.38 14.15,5.38 14.15,7.71 20.86,14.42 | 20.86,14.42 22.94,16.5 24.3,16.5 24.98,17.18 26.38,17.18 28.99,14.57 29.83,14.57 v29.94,14.68 | 20.86,14.42 22.85,14.42 TP_RESET.TP
  Top 0.152: v30.59,15.43 30.59,15.49 U1.P$AC13
  Route2 0.15: v29.94,14.68 30.59,15.32 v30.59,15.43
SCK  (via drill 0.3 pad 0.5)
  Top 0.127: v38,16.41 37.52,15.93 U1.P$A12
  Top 0.15: J1.13 11.85,17.15 12.58,17.88 15.15,17.88 15.16,17.87 15.54,18.25 | 15.54,18.25 | 15.54,18.25 19.49,18.25 20.4,17.34 20.4,16.47 20.44,16.43 v20.44,16.14
  Bottom 0.127: 31.26,16.89 36.09,16.89 37.07,17.88 37.88,17.88 38.23,17.52 38.23,16.64 v38,16.41
  Bottom 0.15: v20.44,16.14 20.46,16.12 23.92,16.12 25.39,17.59 26.41,17.59 27.19,16.81 31.18,16.81 31.26,16.89
SCL  (via drill 0 layers 1-2)
  Top 0.15: U3.7 38.92,26.95 | 38.92,26.95 37.77,26.95 37.3,26.48 | IC3.12 36.95,26.12 37.3,26.48 | 38.92,26.95 37.28,28.59 36.66,28.59 | 36.66,28.59 33.86,28.59 32.86,29.59 | 32.86,29.59 31.48,30.97 IC2.C1 | 37.3,23.91 37.3,22.74 34.04,19.48 v34.04,19.16 v34.04,19.15 | 37.3,23.91 37.3,25.24 | 37.3,25.24 37.3,26.48 | 32.86,29.59 32.86,25.77 31.79,24.7 30.62,24.7 IC1.B1 | 37.3,25.24 37.97,24.57 TP_SCL.TP | v33.78,18.62 33.59,18.43 U1.P$M2 | R4.1 36.61,28.64 36.66,28.59 | R17.2 37.28,23.89 37.3,23.91
  Route2 0.15: v34.04,19.15 34.04,18.88 v33.78,18.62
SDA  (via drill 0 layers 1-2, 0.3 pad 0.5, 0.35 pad 0.5)
  Top 0.15: 39.03,26.45 U3.8 41.63,24.52 TP_SDA.TP | 39.03,26.45 38.85,26.45 | v33.26,31.43 33.24,31.41 | IC2.B2 32.01,31.69 32.01,31.67 v32.22,31.46 | 39.03,26.45 39.01,26.43 v38.7,26.43 | v35.42,27.93 v35.41,27.94 35.41,27.63 35.42,27.63 IC3.2 | v31.48,25.17 30.54,25.17 IC1.C1 | U1.P$L1 33.74,18.96 33.74,19.59 36.81,22.65 v36.81,22.95 36.81,22.73 R18.2 | R2.1 38.59,27.91 v38.63,27.91
  Route2 0.15: v32.22,31.46 33.23,31.46 v33.26,31.43
  Bottom 0.15: 35.4,27.99 33.26,30.13 v33.26,31.43 | v38.69,26.42 v38.7,26.43 38.14,26.43 | 38.14,26.43 37.48,26.43 | 37.48,26.43 36.96,26.43 35.84,27.55 35.4,27.99 | 38.14,26.43 36.81,25.1 v36.81,22.95 | v31.48,25.17 31.79,25.17 34.6,27.99 35.36,27.99 | 35.36,27.99 v35.41,27.94 | 37.48,26.43 38.63,27.58 v38.63,27.91 | 35.4,27.99 35.36,27.99
SWDCLK
  Top 0.15: J2.4 24.02,9.1 26.81,9.1 | 26.81,9.1 28.55,9.1 31.76,9.1 32.42,9.75 32.42,11.35 31.33,12.43 U1.P$AA24 | 26.81,9.1 28.25,7.66 TP_SWDCLK.TP
SWDIO
  Top 0.15: J2.2 23.55,9.89 23.55,11.44 24.41,12.31 26.11,12.31 26.6,11.82 26.6,11.24 | 26.6,11.24 26.6,10.04 27.26,9.38 31.58,9.38 32.13,9.93 32.13,11.13 30.82,12.43 U1.P$AC24 | 26.6,11.24 26.89,10.95 TP_SWDIO.TP
SWO
  Top 0.15: U1.P$AD22 27.32,13.43 TP_SWO.TP
VBAT  (via drill 0.35)
  Top 0.2: 28.25,25.19 C37.2 | 42.94,27.04 C27.2 41.68,26.94 U3.2 U3.3
  Top 0.305: IC1.C2 28.26,25.19 | 28.26,25.19 28.25,25.19 | 28.26,25.19 28.26,25.86 v28.36,25.96 | 42.94,27.04 43.52,27.04 v43.67,26.9 44.69,25.88 TP_VBAT.TP
  Route2 0.305: 43.17,26.87 42.26,26.87 36.41,32.72 33.19,32.72 33.17,32.75 31.11,32.75 28,29.64 28,26.64 28.36,26.27 v28.36,25.96 | 43.17,26.87 43.64,26.87 v43.67,26.9 | 43.17,26.87 43.2,26.9 v43.67,26.9
VBUS  (via drill 0.35)
  Top 0.2: C43.1 C42.1
  Top 0.203: v30.13,23.59 IC1.A2 | 30.16,23.56 C38.2
  Top 0.305: J4.A9_B4 9.68,28.01 v9.67,28 | v14.12,27.92 14.48,28.29 J4.A4_B9 | D3.5 17.62,21.32 v17.15,21.79 17.15,23.55 C43.1 | U1.P$AD2 29.84,18.43 C21.1 28.7,19.04 v28.32,19.42 | 30.16,23.56 v30.13,23.59
  Route2 0.305: 17,25.05 17.15,24.9 v17.15,21.79 | 17,25.05 23.39,25.05 26.18,22.26 | 26.18,22.26 26.23,22.2 28.07,22.2 29.46,23.59 v30.13,23.59 | 26.18,22.26 28.32,20.12 v28.32,19.42 | 26.18,22.26 | 17,25.05 v14.12,27.92 9.75,27.92 v9.67,28
VREG  (via drill 0.35)
  Top 0.15: 30.09,24.74 IC1.B2
  Top 0.2: 35,30.18 C23.2
  Top 0.254: 30.09,24.74 29.05,24.74
  Top 0.305: 29.05,24.74 C39.1 28.31,23.44 v27.82,22.96 | v38.5,33.18 38.5,32.02 | 38.5,32.02 IC9.A2 IC9.A3 | 38.5,32.02 38.1,32.02 IC9.A1 37.53,31.97 37.15,31.59 | 37.15,31.59 C24.2 35,30.18 | 37.15,31.64 37.15,31.59 | 37.15,31.59 36.82,31.93 TP_VREG.TP
  Route2 0.305: v38.5,33.18 30.9,33.18 27.57,29.85 27.57,23.21 v27.82,22.96

### Text on the board
tNames: CHECK LEFT / CORNER